# EAGLE design Proiect_TSC (EAGLE 9.7.0)
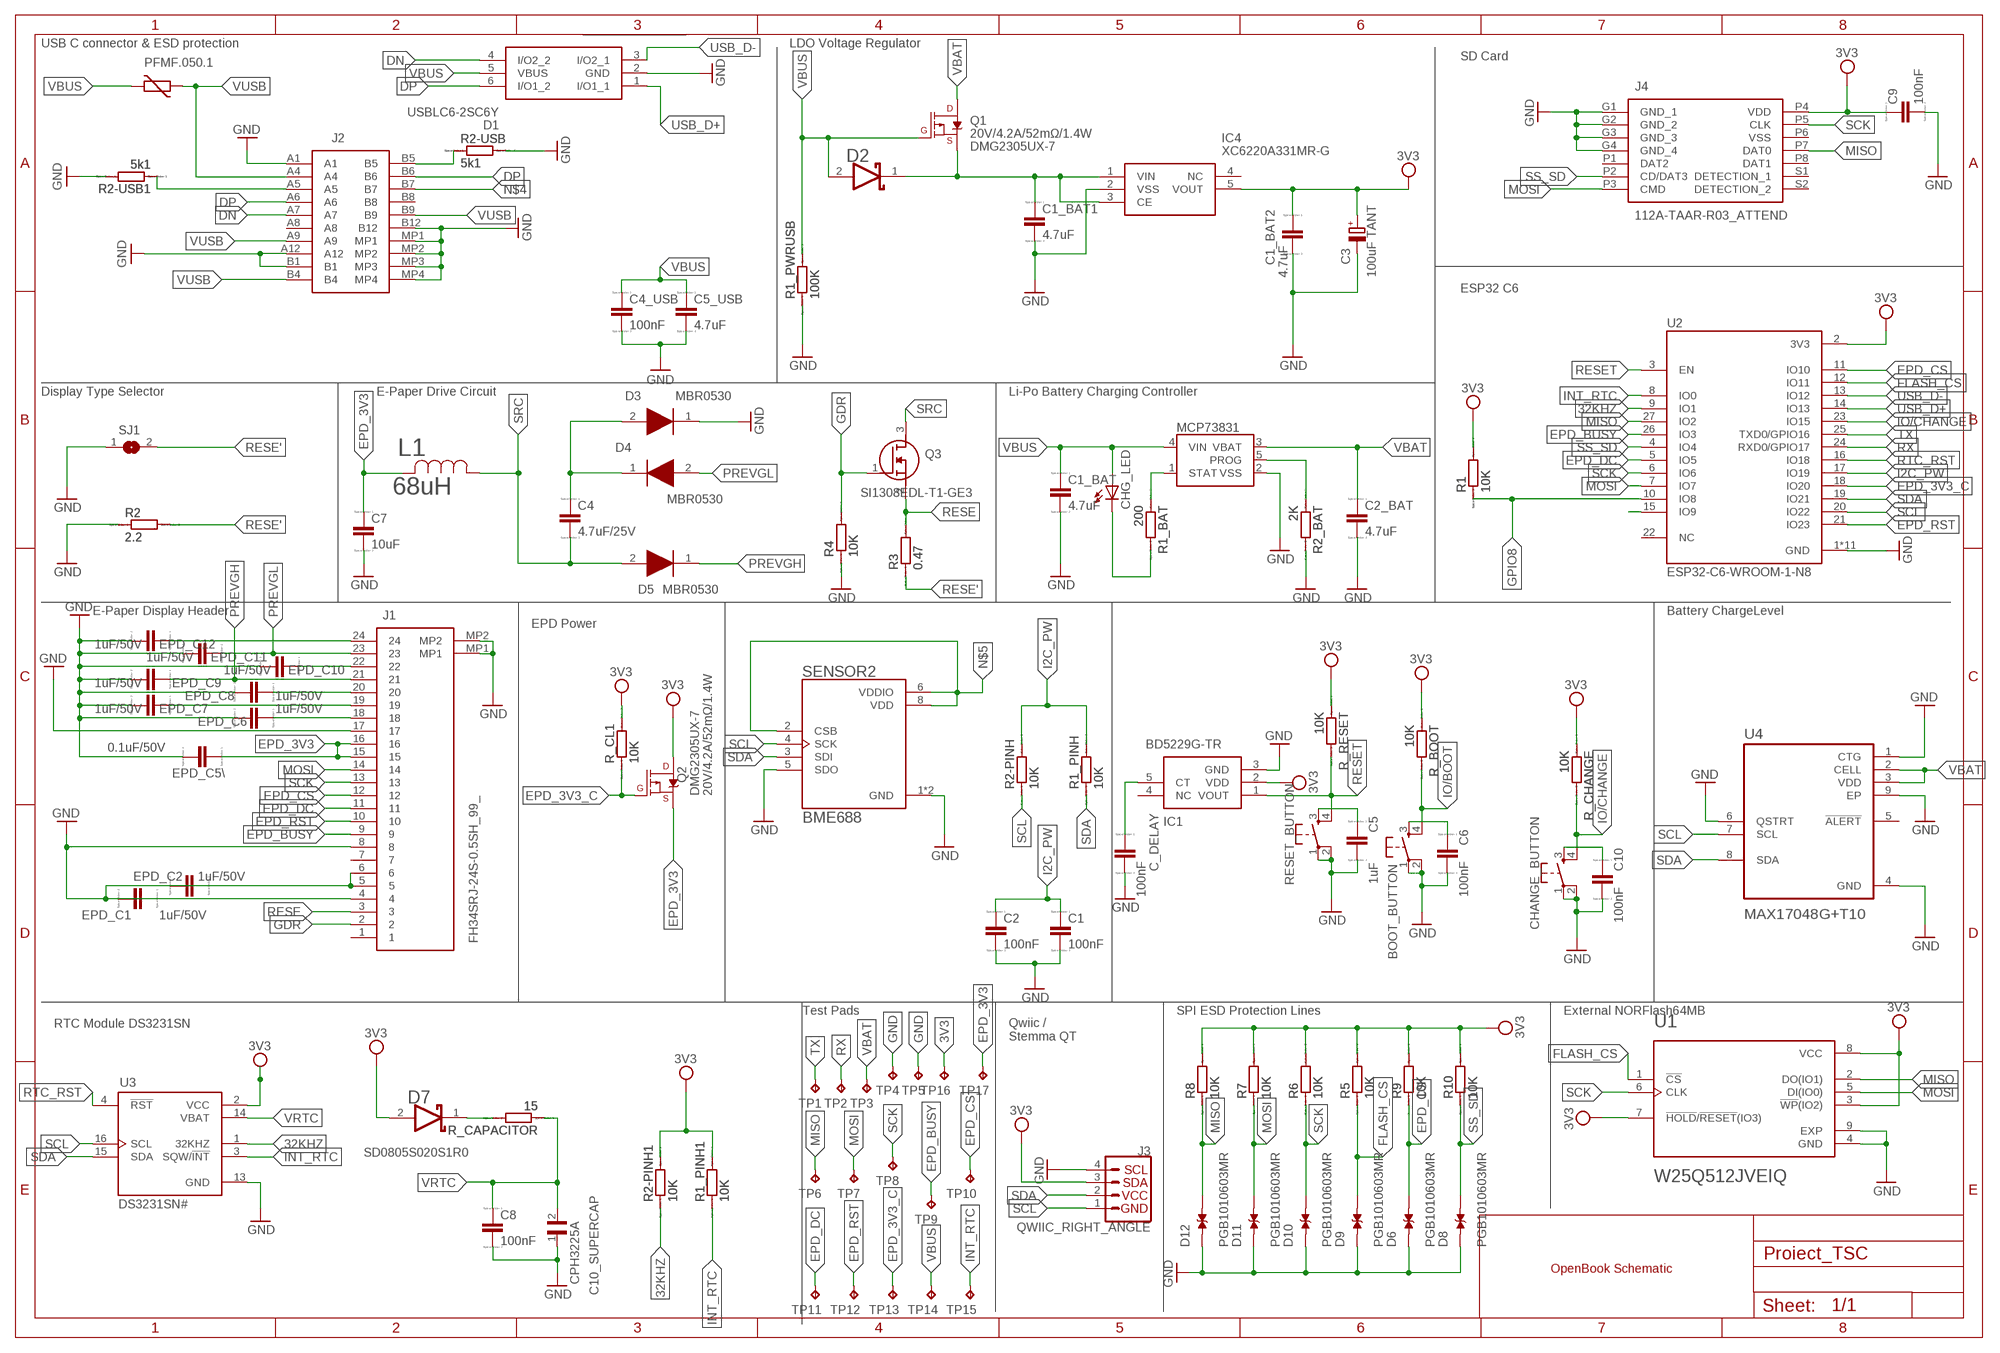
[diagram p0: schematic, sheet 1]

## Parts
BOOT_BUTTON  BUTTON_CUSYOMV1  [MYBUTTON]
C1  100nF  ESP32_WROVER_EAGLE-LTSPICE_CC0402  [ESP32_WROVER_EAGLE-LTSPICE_C0402]
C1_BAT  4.7uF  ESP32_WROVER_EAGLE-LTSPICE_CC0402  [ESP32_WROVER_EAGLE-LTSPICE_C0402]
C1_BAT1  4.7uF  ESP32_WROVER_EAGLE-LTSPICE_CC0402  [ESP32_WROVER_EAGLE-LTSPICE_C0402]
C1_BAT2  4.7uF  ESP32_WROVER_EAGLE-LTSPICE_CC0402  [ESP32_WROVER_EAGLE-LTSPICE_C0402]
C2  100nF  ESP32_WROVER_EAGLE-LTSPICE_CC0402  [ESP32_WROVER_EAGLE-LTSPICE_C0402]
C2_BAT  4.7uF  ESP32_WROVER_EAGLE-LTSPICE_CC0402  [ESP32_WROVER_EAGLE-LTSPICE_C0402]
C3  100uF TANT  RCL_CPOL-EUCT3528  [RCL_CT3528]
C4  4.7uF/25V  ESP32_WROVER_EAGLE-LTSPICE_CC0402  [ESP32_WROVER_EAGLE-LTSPICE_C0402]
C4_USB  100nF  ESP32_WROVER_EAGLE-LTSPICE_CC0402  [ESP32_WROVER_EAGLE-LTSPICE_C0402]
C5  1uF  ESP32_WROVER_EAGLE-LTSPICE_CC0402  [ESP32_WROVER_EAGLE-LTSPICE_C0402]
C5_USB  4.7uF  ESP32_WROVER_EAGLE-LTSPICE_CC0402  [ESP32_WROVER_EAGLE-LTSPICE_C0402]
C6  100nF  ESP32_WROVER_EAGLE-LTSPICE_CC0402  [ESP32_WROVER_EAGLE-LTSPICE_C0402]
C7  10uF  ESP32_WROVER_EAGLE-LTSPICE_CC0402  [ESP32_WROVER_EAGLE-LTSPICE_C0402]
C8  100nF  ESP32_WROVER_EAGLE-LTSPICE_CC0402  [ESP32_WROVER_EAGLE-LTSPICE_C0402]
C9  100nF  ESP32_WROVER_EAGLE-LTSPICE_CC0402  [ESP32_WROVER_EAGLE-LTSPICE_C0402]
C10  100nF  ESP32_WROVER_EAGLE-LTSPICE_CC0402  [ESP32_WROVER_EAGLE-LTSPICE_C0402]
C10_SUPERCAP  CPH3225A  [CAPCP3225X100N]
C_DELAY  100nF  ESP32_WROVER_EAGLE-LTSPICE_CC0402  [ESP32_WROVER_EAGLE-LTSPICE_C0402]
CHANGE_BUTTON  BUTTON_CUSYOMV1  [MYBUTTON]
CHG_LED  ADAFRUIT_LEDCHIP-LED0603  [ADAFRUIT_CHIP-LED0603]
D1  USBLC6-2SC6Y  [SOT95P280X145-6N]
D2  ESP32_WROVER_AVX---SD0805S020S1R0_AVX_SD0805S020S1R0_0_0AVX_SD0805S020S1R0_0_0  [ESP32_WROVER_AVX---SD0805S020S1R0_AVX_SD0805S020S1R0_0]
D3  MBR0530  [SOD3716X135N]
D4  MBR0530  [SOD3716X135N]
D5  MBR0530  [SOD3716X135N]
D6  PGB1010603MR  [DIOC1608X36N]
D7  ESP32_WROVER_AVX---SD0805S020S1R0_AVX_SD0805S020S1R0_0_0AVX_SD0805S020S1R0_0_0  [ESP32_WROVER_AVX---SD0805S020S1R0_AVX_SD0805S020S1R0_0]
D8  PGB1010603MR  [DIOC1608X36N]
D9  PGB1010603MR  [DIOC1608X36N]
D10  PGB1010603MR  [DIOC1608X36N]
D11  PGB1010603MR  [DIOC1608X36N]
D12  PGB1010603MR  [DIOC1608X36N]
EPD_C1  1uF/50V  ESP32_WROVER_EAGLE-LTSPICE_CC0402  [ESP32_WROVER_EAGLE-LTSPICE_C0402]
EPD_C2  1uF/50V  ESP32_WROVER_EAGLE-LTSPICE_CC0402  [ESP32_WROVER_EAGLE-LTSPICE_C0402]
EPD_C5\  0.1uF/50V  EAGLE-LTSPICE_CC0402  [EAGLE-LTSPICE_C0402]
EPD_C6  1uF/50V  EAGLE-LTSPICE_CC0402  [EAGLE-LTSPICE_C0402]
EPD_C7  1uF/50V  EAGLE-LTSPICE_CC0402  [EAGLE-LTSPICE_C0402]
EPD_C8  1uF/50V  EAGLE-LTSPICE_CC0402  [EAGLE-LTSPICE_C0402]
EPD_C9  1uF/50V  EAGLE-LTSPICE_CC0402  [EAGLE-LTSPICE_C0402]
EPD_C10  1uF/50V  EAGLE-LTSPICE_CC0402  [EAGLE-LTSPICE_C0402]
EPD_C11  1uF/50V  EAGLE-LTSPICE_CC0402  [EAGLE-LTSPICE_C0402]
EPD_C12  1uF/50V  EAGLE-LTSPICE_CC0402  [EAGLE-LTSPICE_C0402]
IC1  BD5229G-TR  [SOT95P280X125-5N]
IC4  XC6220A331MR-G  [SOT95P280X120-5N]
J1  FH34SRJ-24S-0.5SH_99_  [FH34SRJ24S05SH99]
J2  SAMACSYS_PARTS_USB4110-GF-A  [SAMACSYS_PARTS_USB4110GFA]
J3  QWIIC_RIGHT_ANGLE  QWIIC_CONNECTORJS-1MM  [JST04_1MM_RA]
J4  112A-TAAR-R03_ATTEND  [112ATAARR03ATTEND]
L1  68uH  744043680IND_4828-WE-TPC_WRE  [IND_4828-WE-TPC_WRE]
MCP73831  ESP32_WROVER_SPARKFUN-IC-POWER_MCP73831  [ESP32_WROVER_SPARKFUN-IC-POWER_SOT23-5]
PFMF.050.1  ESP32C6_VARISTORCN1812  [ESP32C6_VARISTOR_CT/CN1812]
Q1  20V/4.2A/52mΩ/1.4W  ESP32_WROVER_SPARKFUN-DISCRETESEMI_MOSFET_PCH-DMG2305UX-7  [ESP32_WROVER_SPARKFUN-DISCRETESEMI_SOT23-3]
Q2  20V/4.2A/52mΩ/1.4W  ESP32_WROVER_SPARKFUN-DISCRETESEMI_MOSFET_PCH-DMG2305UX-7  [ESP32_WROVER_SPARKFUN-DISCRETESEMI_SOT23-3]
Q3  SI1308EDL-T1-GE3  [SOT65P210X110-3N]
R1  10K  ESP32_WROVER_EAGLE-LTSPICE_RR0402  [ESP32_WROVER_EAGLE-LTSPICE_R0402]
R1_BAT  200  ESP32_WROVER_EAGLE-LTSPICE_RR0402  [ESP32_WROVER_EAGLE-LTSPICE_R0402]
R1_PINH  10K  ESP32_WROVER_EAGLE-LTSPICE_RR0402  [ESP32_WROVER_EAGLE-LTSPICE_R0402]
R1_PINH1  10K  ESP32_WROVER_EAGLE-LTSPICE_RR0402  [ESP32_WROVER_EAGLE-LTSPICE_R0402]
R1_PWRUSB  100K  ESP32_WROVER_EAGLE-LTSPICE_RR0402  [ESP32_WROVER_EAGLE-LTSPICE_R0402]
R2  2.2  ESP32_WROVER_EAGLE-LTSPICE_RR0402  [ESP32_WROVER_EAGLE-LTSPICE_R0402]
R2-PINH  10K  ESP32_WROVER_EAGLE-LTSPICE_RR0402  [ESP32_WROVER_EAGLE-LTSPICE_R0402]
R2-PINH1  10K  ESP32_WROVER_EAGLE-LTSPICE_RR0402  [ESP32_WROVER_EAGLE-LTSPICE_R0402]
R2-USB  5k1  ESP32_WROVER_EAGLE-LTSPICE_RR0402  [ESP32_WROVER_EAGLE-LTSPICE_R0402]
R2-USB1  5k1  ESP32_WROVER_EAGLE-LTSPICE_RR0402  [ESP32_WROVER_EAGLE-LTSPICE_R0402]
R2_BAT  2K  ESP32_WROVER_EAGLE-LTSPICE_RR0402  [ESP32_WROVER_EAGLE-LTSPICE_R0402]
R3  0.47  ESP32_WROVER_EAGLE-LTSPICE_RR0402  [ESP32_WROVER_EAGLE-LTSPICE_R0402]
R4  10K  ESP32_WROVER_EAGLE-LTSPICE_RR0402  [ESP32_WROVER_EAGLE-LTSPICE_R0402]
R5  10K  ESP32_WROVER_EAGLE-LTSPICE_RR0402  [ESP32_WROVER_EAGLE-LTSPICE_R0402]
R6  10K  ESP32_WROVER_EAGLE-LTSPICE_RR0402  [ESP32_WROVER_EAGLE-LTSPICE_R0402]
R7  10K  ESP32_WROVER_EAGLE-LTSPICE_RR0402  [ESP32_WROVER_EAGLE-LTSPICE_R0402]
R8  10K  ESP32_WROVER_EAGLE-LTSPICE_RR0402  [ESP32_WROVER_EAGLE-LTSPICE_R0402]
R9  10K  ESP32_WROVER_EAGLE-LTSPICE_RR0402  [ESP32_WROVER_EAGLE-LTSPICE_R0402]
R10  10K  ESP32_WROVER_EAGLE-LTSPICE_RR0402  [ESP32_WROVER_EAGLE-LTSPICE_R0402]
R_BOOT  10K  ESP32_WROVER_EAGLE-LTSPICE_RR0402  [ESP32_WROVER_EAGLE-LTSPICE_R0402]
R_CAPACITOR  15  ESP32_WROVER_EAGLE-LTSPICE_RR0402  [ESP32_WROVER_EAGLE-LTSPICE_R0402]
R_CHANGE  10K  ESP32_WROVER_EAGLE-LTSPICE_RR0402  [ESP32_WROVER_EAGLE-LTSPICE_R0402]
R_CL1  10K  ESP32_WROVER_EAGLE-LTSPICE_RR0402  [ESP32_WROVER_EAGLE-LTSPICE_R0402]
R_RESET  10K  ESP32_WROVER_EAGLE-LTSPICE_RR0402  [ESP32_WROVER_EAGLE-LTSPICE_R0402]
RESET_BUTTON  BUTTON_CUSYOMV1  [MYBUTTON]
SENSOR2  BME688  ESP32_WROVER_BME680_BME680  [ESP32_WROVER_BME680_PSON80P300X300X100-8N]
SJ1  SJ  [SJ]
TP1  TPTP20R  [TP20R]
TP2  TPTP20R  [TP20R]
TP3  TPTP20R  [TP20R]
TP4  TPTP20R  [TP20R]
TP5  TPTP20R  [TP20R]
TP6  TPTP20R  [TP20R]
TP7  TPTP20R  [TP20R]
TP8  TPTP20R  [TP20R]
TP9  TPTP20R  [TP20R]
TP10  TPTP20R  [TP20R]
TP11  TPTP20R  [TP20R]
TP12  TPTP20R  [TP20R]
TP13  TPTP20R  [TP20R]
TP14  TPTP20R  [TP20R]
TP15  TPTP20R  [TP20R]
TP16  TPTP20R  [TP20R]
TP17  TPTP20R  [TP20R]
U1  W25Q512JVEIQ  [SON127P600X800X80-9N]
U2  ESP32-C6-WROOM-1-N8  [XCVR_ESP32-C6-WROOM-1-N8]
U3  DS3231SN#  [SOIC127P1032X265-16N]
U4  MAX17048G+T10  [SON50P200X200X80-9N]

## Nets
3V3: C1_BAT2.1 C3.+ C9.1 D7.2(ANODE) IC1.2(VDD) IC4.5(VOUT) J3.3 J4.P4(VDD) Q2.3(D) R1.2 R1_PINH1.2 R2-PINH1.2 R5.2 R6.2 R7.2 R8.2 R9.2 R10.2 R_BOOT.1 R_CHANGE.1 R_CL1.2 R_RESET.1 TP16.TP U1.3(!WP!(IO2)) U1.7(!HOLD!/!RESET!(IO3)) U1.8(VCC) U2.2(3V3) U3.2(VCC)
32KHZ: R2-PINH1.1 U2.9(IO1) U3.1(32KHZ)
DN: D1.4(I/O2_2) J2.A7
DP: D1.6(I/O1_2) J2.A6 J2.B6
EPD_3V3: C7.1 EPD_C5\.1 J1.15 J1.16 L1.2 Q2.2(S) TP17.TP
EPD_3V3_C: Q2.1(G) R_CL1.1 TP13.TP U2.18(IO20)
EPD_BUSY: J1.9 TP9.TP U2.26(IO3)
EPD_C2: EPD_C2.2 J1.5 J1.6
EPD_CS: D6.2 J1.12 R9.1 TP10.TP U2.11(IO10)
EPD_DC: J1.11 TP11.TP U2.5(IO5)
EPD_RST: J1.10 TP12.TP U2.21(IO23)
FLASH_CS: D9.2 R5.1 U1.1(!CS) U2.12(IO11)
GDR: J1.2 Q3.1(G) R4.2
GND: BOOT_BUTTON.2 C1.2 C1_BAT1.2 C1_BAT2.2 C1_BAT.2 C2.2 C2_BAT.2 C3.- C4_USB.2 C5.2 C5_USB.2 C6.2 C7.2 C8.2 C9.2 C10.2 C10_SUPERCAP.1 C_DELAY.2 CHANGE_BUTTON.2 D1.2(GND) D3.1(K) D6.1 D8.1 D9.1 D10.1 D11.1 D12.1 EPD_C1.1 EPD_C2.1 EPD_C5\.2 EPD_C6.2 EPD_C7.2 EPD_C8.2 EPD_C9.2 EPD_C10.2 EPD_C11.2 EPD_C12.2 IC1.3(GND) IC4.2(VSS) J1.8 J1.17 J1.MP1 J1.MP2 J2.A1 J2.A12 J2.B1 J2.B12 J2.MP1 J2.MP2 J2.MP3 J2.MP4 J3.4 J4.G1(GND_1) J4.G2(GND_2) J4.G3(GND_3) J4.G4(GND_4) MCP73831.2(VSS) R1_PWRUSB.1 R2-USB1.2 R2-USB.2 R2.1 R2_BAT.2 R4.1 RESET_BUTTON.1 RESET_BUTTON.2 SENSOR2.1(GND) SENSOR2.5(SDO) SENSOR2.7(GND) SJ1.1 TP4.TP TP5.TP U1.4(GND) U1.9(EXP) U2.1(GND) U2.28(GND) U2.29_1(GND) U2.29_2(GND) U2.29_3(GND) U2.29_4(GND) U2.29_5(GND) U2.29_6(GND) U2.29_7(GND) U2.29_8(GND) U2.29_9(GND) U3.13(GND) U4.1(CTG) U4.4(GND) U4.6(QSTRT) U4.9(EP)
GPIO8: R1.1 U2.10(IO8)
I2C_PW: C1.1 C2.1 R1_PINH.2 R2-PINH.2 U2.17(IO19)
INT_RTC: R1_PINH1.1 TP15.TP U2.8(IO0) U3.3(SQW/!INT)
IO/BOOT: BOOT_BUTTON.4 R_BOOT.2
IO/CHANGE: CHANGE_BUTTON.4 R_CHANGE.2 U2.23(IO15)
MISO: D12.2 J4.P7(DAT0) R8.1 TP6.TP U1.2(DO(IO1)) U2.27(IO2)
MOSI: D11.2 J1.14 J4.P3(CMD) R7.1 TP7.TP U1.5(DI(IO0)) U2.7(IO7)
N$1: J2.A5 R2-USB1.1
N$2: J2.B5 R2-USB.1
N$3: C1_BAT1.1 D2.1(CATHODE) IC4.1(VIN) IC4.3(CE) Q1.2(S)
N$4: J2.B7
N$5: SENSOR2.2(CSB) SENSOR2.6(VDDIO) SENSOR2.8(VDD)
N$6: MCP73831.5(PROG) R2_BAT.1
N$7: C4.1 D3.2(A) D4.1(K)
N$8: C_DELAY.1 IC1.5(CT)
N$9: EPD_C1.2 J1.4
N$10: MCP73831.1(STAT) R1_BAT.1
N$11: CHG_LED.C R1_BAT.2
N$12: EPD_C6.1 J1.18
N$13: EPD_C7.1 J1.19
N$14: EPD_C8.1 J1.20
N$15: D7.1(CATHODE) R_CAPACITOR.2
N$16: EPD_C10.1 J1.22
N$17: BOOT_BUTTON.3 C6.1
N$18: EPD_C12.1 J1.24
N$19: C5.1 RESET_BUTTON.3
N$20: BOOT_BUTTON.1
N$21: C10.1 CHANGE_BUTTON.3
N$22: CHANGE_BUTTON.1
N$33: U2.15(IO9)
PREVGH: D5.1(K) EPD_C9.1 J1.21
PREVGL: D4.2(A) EPD_C11.1 J1.23
RESE: J1.3 Q3.2(S) R3.2
RESE': R2.2 R3.1 SJ1.2
RESET: IC1.1(VOUT) R_RESET.2 RESET_BUTTON.4 U2.3(EN)
RTC_RST: U2.16(IO18) U3.4(!RST)
RX: TP2.TP U2.24(RXD0/GPIO17)
SCK: D10.2 J1.13 J4.P5(CLK) R6.1 TP8.TP U1.6(CLK) U2.6(IO6)
SCL: J3.1 R2-PINH.1 SENSOR2.4(SCK) U2.20(IO22) U3.16(SCL) U4.7(SCL)
SDA: J3.2 R1_PINH.1 SENSOR2.3(SDI) U2.19(IO21) U3.15(SDA) U4.8(SDA)
SRC: C4.2 D5.2(A) L1.1 Q3.3(D)
SS_SD: D8.2 J4.P2(CD/DAT3) R10.1 U2.4(IO4)
TX: TP1.TP U2.25(TXD0/GPIO16)
USB_D+: D1.1(I/O1_1) U2.14(IO13)
USB_D-: D1.3(I/O2_1) U2.13(IO12)
VBAT: C2_BAT.1 MCP73831.3(VBAT) Q1.3(D) TP3.TP U4.2(CELL) U4.3(VDD)
VBUS: C1_BAT.1 C4_USB.1 C5_USB.1 CHG_LED.A D1.5(VBUS) D2.2(ANODE) MCP73831.4(VIN) PFMF.050.1.2 Q1.1(G) R1_PWRUSB.2 TP14.TP
VRTC: C8.1 C10_SUPERCAP.2 R_CAPACITOR.1 U3.14(VBAT)
VUSB: J2.A4 J2.A9 J2.B4 J2.B9 PFMF.050.1.1
Unconnected: IC1.4(NC) IC4.4(NC) J1.1 J1.7 J2.A8 J2.B8 J4.P1(DAT2) J4.P6(VSS) J4.P8(DAT1) J4.S1(DETECTION_1) J4.S2(DETECTION_2) U2.22(NC) U4.5(!ALERT)

## Notes on the sheet
- USB C connector & ESD protection | LDO Voltage Regulator
- SD Card
- DMG2305UX-7
- ESP32 C6
- Display Type Selector | E-Paper Drive Circuit | Li-Po Battery Charging Controller
- E-Paper Display Header | Battery ChargeLevel
- EPD Power
- DMG2305UX-7
- Test Pads | SPI ESD Protection Lines | External NORFlash64MB
- RTC Module DS3231SN
- Qwiic /
  Stemma QT
- SD0805S020S1R0
- OpenBook Schematic

## Library data of the parts
BOOT_BUTTON CHANGE_BUTTON RESET_BUTTON = DeskAssistant v19 v1:BUTTON_CUSYOMV1
C1 C1_BAT C1_BAT1 C1_BAT2 C2 C2_BAT C4 C4_USB C5 C5_USB C6-C10 C_DELAY EPD_C1 EPD_C2 = DeskAssistant v19 v1:ESP32_WROVER_EAGLE-LTSPICE_C: CAPACITOR, European symbol; SPICEMODEL: NONE; SPICEPREFIX: C
C3 = DeskAssistant v19 v1:RCL_CPOL-EU: POLARIZED CAPACITOR, European symbol; SPICEPREFIX: C
C10_SUPERCAP = DeskAssistant v19 v1:CPH3225A: Cap 0.011F 3.3V 1210 Flat Check availability <https://pricing.snapeda.com/parts/CPH3225A/Seiko%20Instruments/view-part?ref=eda>; AVAILABILITY: Not in stock; CHECK_PRICES: https://www.snapeda.com/parts/CPH3225A/Seiko+Instruments/view-part/?ref=eda; DESCRIPTION: 11 mF (EDLC) Supercapacitor 3.3 V 1210 (3225 Metric) - -; MF: Seiko Instruments; MP: CPH3225A; PACKAGE: 1210 Seiko; PRICE: None; PURCHASE-URL: https://www.snapeda.com/api/url_track_click_mouser/?unipart_id=562593&manufacturer=Seiko Instruments&part_name=CPH3225A&search_term=None; SNAPEDA_LINK: https://www.snapeda.com/parts/CPH3225A/Seiko+Instruments/view-part/?ref=snap
CHG_LED = DeskAssistant v19 v1:ADAFRUIT_LED: LED OSRAM: - CHIPLED LG R971, LG N971, LY N971, LG Q971, LY Q971, LO R971, LY R971 LH N974, LH R974 LS Q976, LO Q976, LY Q976 LO Q996 - Hyper CHIPLED LW Q18S LB Q993, LB Q99A, LB R99A - SideLED LS A670, LO A670, LY A670, LG A670, LP A670 LB A673, LV A673, LT A673, LW A673 LH A674 LY A675 LS A676, LA A676, LO A676, LY A676, LW A676 LS A679, LY A679, LG A679 - Hyper Micro SIDELED® LS Y876, LA Y876, LO Y876, LY Y876 LT Y87S - SmartLED LW L88C, LW L88S LB L89C, LB L89S, LG L890 LS L89K, LO L89K, LY L89K LS L896, LA L896, LO L896, LY L896 - TOPLED LS T670, LO T670, LY T670, LG T670, LP T670 LSG T670, LSP T670, LSY T670, LOP T670, LYG T670 LG T671, LOG T671, LSG T671 LB T673, LV T673, LT T673, LW T673 LH T674 LS T676, LA T676, LO T676, LY T676, LB T676, LH T676, LSB T676, LW T676 LB T67C, LV T67C, LT T67C, LS T67K, LO T67K, LY T67K, LW E67C LS E67B, LA E67B, LO E67B, LY E67B, LB E67C, LV E67C, LT E67C LW T67C LS T679, LY T679, LG T679 LS T770, LO T770, LY T770, LG T770, LP T770 LB T773, LV T773, LT T773, LW T773 LH T774 LS E675, LA E675, LY E675, LS T675 LS T776, LA T776, LO T776, LY T776, LB T776 LHGB T686 LT T68C, LB T68C - Hyper Mini TOPLED® LB M676 - Mini TOPLED Santana® LG M470 LS M47K, LO M47K, LY M47K Source: http://www.osram.convergy.de/
D1 = DeskAssistant v19 v1:USBLC6-2SC6Y: Low Cap. ESD Protection Auto SOT-23-6 STMicroelectronics USBLC6-2SC6Y, Dual Uni-Directional TVS Diode Array, 6-Pin SOT-23 Source: Datasheet <https://componentsearchengine.com/Datasheets/1/USBLC6-2SC6Y.pdf> Check availability <https://pricing.snapeda.com/parts/USBLC6-2SC6Y/STMicroelectronics/view-part?ref=eda>; AVAILABILITY: In Stock; CHECK_PRICES: https://www.snapeda.com/parts/USBLC6-2SC6Y/STMicroelectronics/view-part/?ref=eda; DESCRIPTION: 17V Clamp 5A (8/20µs) Ipp Tvs Diode Surface Mount SOT-23-6; MF: STMicroelectronics; MP: USBLC6-2SC6Y; PACKAGE: SOT-23-6 STMicroelectronics; PRICE: None; SNAPEDA_LINK: https://www.snapeda.com/parts/USBLC6-2SC6Y/STMicroelectronics/view-part/?ref=snap
D2 D7 = DeskAssistant v19 v1:ESP32_WROVER_AVX---SD0805S020S1R0_AVX_SD0805S020S1R0_0_0: Schottky Barrier Rectifier Diode; CENTROID_NOT_SPECIFIED: No; DATASHEET: http://datasheets.avx.com/schottky.pdf; DIGIKEY_DESCRIPTION: DIODE SCHOTTKY 20V 1A 0805; DIGIKEY_PART_NUMBER: 478-7800-1-ND; LEAD_FREE: yes; MF: AVX; MOUSER_PART_NUMBER: 581-SD0805S020S1R0; PACKAGE: 0805 (2012 metric); PREFIX: D; ROHS: yes; TEMPERATURE_RANGE_HIGH: +125°C; TEMPERATURE_RANGE_LOW: -55°C
D3-D5 = DeskAssistant v19 v1:MBR0530: ON SEMICONDUCTOR - MBR0530 - DIODE, SCHOTTKY, 0.5A, 30V, SOD-123 Source: Datasheet <http://www.onsemi.com/pub/Collateral/MBR0530T1-D.PDF> Check availability <https://pricing.snapeda.com/parts/MBR0530/ON%20Semiconductor/view-part?ref=eda>; AVAILABILITY: In Stock; CHECK_PRICES: https://www.snapeda.com/parts/MBR0530/Onsemi/view-part/?ref=eda; DESCRIPTION: Diode Schottky 30 V 500mA Surface Mount SOD-123; MF: ON Semiconductor; MP: MBR0530; PACKAGE: SOD-123-2 ON Semiconductor; PRICE: None; PURCHASE-URL: https://www.snapeda.com/api/url_track_click_mouser/?unipart_id=179458&manufacturer=ON Semiconductor&part_name=MBR0530&search_term=None; SNAPEDA_LINK: https://www.snapeda.com/parts/MBR0530/Onsemi/view-part/?ref=snap
D6 D8-D12 = DeskAssistant v19 v1:PGB1010603MR: Check availability <https://pricing.snapeda.com/parts/PGB1010603MR/Littelfuse%20Inc./view-part?ref=eda>; AVAILABILITY: In Stock; CHECK_PRICES: https://www.snapeda.com/parts/PGB1010603MR/Littelfuse/view-part/?ref=eda; DESCRIPTION: 150V (Typ) Clamp - Ipp Tvs Diode Surface Mount 0603 (1608 Metric); MF: Littelfuse Inc.; MP: PGB1010603MR; PACKAGE: 0603 Littelfuse Inc.; PRICE: None; PURCHASE-URL: https://www.snapeda.com/api/url_track_click_mouser/?unipart_id=5659453&manufacturer=Littelfuse Inc.&part_name=PGB1010603MR&search_term=None; SNAPEDA_LINK: https://www.snapeda.com/parts/PGB1010603MR/Littelfuse/view-part/?ref=snap
EPD_C5\ EPD_C6-EPD_C12 = DeskAssistant v19 v1:EAGLE-LTSPICE_C: CAPACITOR, European symbol; SPICEMODEL: NONE; SPICEPREFIX: C
IC1 = DeskAssistant v19 v1:BD5229G-TR: Voltage Detector with Adjustable Delay Time: CMOS processes are utilized to develop high precision, low current consumption CMOS reset ICs that allow arbitrary setting of the delay time. The extensive lineup includes both Nch Open Drain and CMOS output types in a wide range of detection voltages (from 2.3V to 6.0V, in 0.1V steps), enabling selection of the ideal solution based on customer requirements. In addition, the entire series is of course both lead-free and RoHS-compliant. Source: Datasheet <https://datasheet.datasheetarchive.com/originals/distributors/Datasheets_SAMA/f2b9741ef86007909f138d561a359946.pdf>; DESCRIPTION: Voltage Detector with Adjustable Delay Time: CMOS processes are utilized to develop high precision, low current consumption CMOS reset ICs that allow arbitrary setting of the delay time. The extensive lineup includes both Nch Open Drain and CMOS output types in a wide range of detection voltages (from 2.3V to 6.0V, in 0.1V steps), enabling selection of the ideal solution based on customer requirements. In addition, the entire series is of course both lead-free and RoHS-compliant.; HEIGHT: 1.25mm; MANUFACTURER_NAME: ROHM Semiconductor; MANUFACTURER_PART_NUMBER: BD5229G-TR; MOUSER_PART_NUMBER: 755-BD5229G-TR; MOUSER_PRICE-STOCK: https://www.mouser.co.uk/ProductDetail/ROHM-Semiconductor/BD5229G-TR?qs=4kLU8WoGk0vvnhrrYwdszw%3D%3D
IC4 = DeskAssistant v19 v1:XC6220A331MR-G: LDO Voltage Regulators Source: Datasheet <https://www.torexsemi.com/file/xc6220/XC6220.pdf>; DESCRIPTION: LDO Voltage Regulators; HEIGHT: 1.2mm; MANUFACTURER_NAME: Torex; MANUFACTURER_PART_NUMBER: XC6220A331MR-G; MOUSER_PART_NUMBER: 865-XC6220A331MR-G; MOUSER_PRICE-STOCK: https://www.mouser.co.uk/ProductDetail/Torex-Semiconductor/XC6220A331MR-G?qs=AsjdqWjXhJ8ZSWznL1J0gg%3D%3D
J1 = DeskAssistant v19 v1:FH34SRJ-24S-0.5SH_99_: 24 Position FFC, FPC Connector Contacts, Top and Bottom 0.020" (0.50mm) Surface Mount, Right Angle Source: Datasheet <https://www.hirose.com/en/product/document?clcode=CL0580-1255-6-99&productname=FH34SRJ-24S-0.5SH(99)&series=FH34SRJ&documenttype=2DDrawing&lang=en&documentid=0000990903>; DESCRIPTION: 24 Position FFC, FPC Connector Contacts, Top and Bottom 0.020" (0.50mm) Surface Mount, Right Angle; HEIGHT: 1.1mm; MANUFACTURER_NAME: Hirose; MANUFACTURER_PART_NUMBER: FH34SRJ-24S-0.5SH(99); MOUSER_PART_NUMBER: 798-FH34SRJ24S05SH99; MOUSER_PRICE-STOCK: https://www.mouser.co.uk/ProductDetail/Hirose-Connector/FH34SRJ-24S-0.5SH99?qs=vcbW%252B4%252BSTIpKBl5ap9J8Fw%3D%3D
J2 = DeskAssistant v19 v1:SAMACSYS_PARTS_USB4110-GF-A: CONN USB 2.0 TYPE-C R/A SMT Source: Datasheet <https://gct.co/files/drawings/usb4110.pdf>; DESCRIPTION: CONN USB 2.0 TYPE-C R/A SMT; HEIGHT: 3.26mm; MANUFACTURER_NAME: GCT (GLOBAL CONNECTOR TECHNOLOGY); MANUFACTURER_PART_NUMBER: USB4110-GF-A; MOUSER_PART_NUMBER: 640-USB4110-GF-A; MOUSER_PRICE-STOCK: https://www.mouser.co.uk/ProductDetail/GCT/USB4110-GF-A?qs=KUoIvG%2F9IlYiZvIXQjyJeA%3D%3D
J3 = DeskAssistant v19 v1:QWIIC_CONNECTOR: SparkFun I2C Standard Qwiic Connector An SMD 1mm pitch JST connector makes it easy and quick (get it? Qwiic?) to connect I2C devices to each other. The Qwiic system <http://www.sparkfun.com/qwiic> enables fast and solderless connection between popular platforms and various sensors and actuators. We carry 200mm <https://www.sparkfun.com/products/14204>, 100mm <https://www.sparkfun.com/products/14205>, 50mm <https://www.sparkfun.com/products/14206>, and breadboard friendly <https://www.sparkfun.com/products/14207> Qwiic cables. We also offer 10 pcs strips <https://www.sparkfun.com/products/14323> the SMD connectors.; PROD_ID: CONN-13694
J4 = DeskAssistant v19 v1:112A-TAAR-R03_ATTEND: Micro SD Card Socket, Push-Push Type, Top Mount, SMT, H=1.83mm, 10u Source: Datasheet <https://www.attend.com.tw/data/download/file/112A-TAAR-R03.pdf>; DESCRIPTION: Micro SD Card Socket, Push-Push Type, Top Mount, SMT, H=1.83mm, 10u; HEIGHT: 1.9mm; MANUFACTURER_NAME: ATTEND; MANUFACTURER_PART_NUMBER: 112A-TAAR-R03 ATTEND
L1 = DeskAssistant v19 v1:744043680; COPYRIGHT: Copyright (C) 2024 Ultra Librarian. All rights reserved.; MANUFACTURER_PART_NUMBER: 744043680; MFR_NAME: Wurth Electronics
MCP73831 = DeskAssistant v19 v1:ESP32_WROVER_SPARKFUN-IC-POWER_MCP73831: MCP73831T Li-Ion, Li-Pol Controller Miniature single cell, fully integrated Li-Ion, Li-polymer charge management controller Datasheet <http://ww1.microchip.com/downloads/en/DeviceDoc/20001984g.pdf> SparkFun Products: SparkFun ESP32 Thing <https://www.sparkfun.com/products/13907> SparkFun 9DoF Razor IMU M0 <https://www.sparkfun.com/products/14001>; PROD_ID: IC-09995
PFMF.050.1 = DeskAssistant v19 v1:ESP32C6_VARISTOR: VARISTOR
Q1 Q2 = DeskAssistant v19 v1:ESP32_WROVER_SPARKFUN-DISCRETESEMI_MOSFET_PCH: P-channel MOSFETs Voltage controlled devices that allow control of high current outputs. SparkFun Products: SparkFun ESP32 Thing <https://www.sparkfun.com/products/13907> SparkFun ESP8266 Thing <https://www.sparkfun.com/products/13231> SparkFun Pi Servo HAT V2 <https://www.sparkfun.com/products/15316> DMG2305UX-7 (20V/4.2A/SOT23-3); PROD_ID: TRAN-14388
Q3 = DeskAssistant v19 v1:SI1308EDL-T1-GE3: MOSFET N-Ch 30V 1.5A TrenchFET SC70 Vishay Si1308EDL-T1-GE3 N-channel MOSFET Transistor, 1.5 A, 30 V, 3-Pin SC-70 Source: Datasheet <https://componentsearchengine.com/Datasheets/1/SI1308EDL-T1-GE3.pdf> Check availability <https://pricing.snapeda.com/parts/SI1308EDL-T1-GE3/Vishay%20Siliconix/view-part?ref=eda>; AVAILABILITY: In Stock; CHECK_PRICES: https://www.snapeda.com/parts/SI1308EDL-T1-GE3/Vishay+Siliconix/view-part/?ref=eda; DESCRIPTION: Si1308EDL-T1-GE3 N-channel MOSFET Transistor, 1.5 A, 30 V, 3-Pin SC-70 | Siliconix / Vishay SI1308EDL-T1-GE3; MF: Vishay Siliconix; MP: SI1308EDL-T1-GE3; PACKAGE: SOT-323 Vishay Semiconductor; PRICE: None; PURCHASE-URL: https://www.snapeda.com/api/url_track_click_mouser/?unipart_id=274603&manufacturer=Vishay Siliconix&part_name=SI1308EDL-T1-GE3&search_term=None; SNAPEDA_LINK: https://www.snapeda.com/parts/SI1308EDL-T1-GE3/Vishay+Siliconix/view-part/?ref=snap
R1 R1_BAT R1_PINH R1_PINH1 R1_PWRUSB R2 R2-PINH R2-PINH1 R2-USB R2-USB1 R2_BAT R3-R10 R_BOOT R_CAPACITOR R_CHANGE R_CL1 R_RESET = DeskAssistant v19 v1:ESP32_WROVER_EAGLE-LTSPICE_R: RESISTOR, European symbol; SPICEMODEL: NONE; SPICEPREFIX: R
SENSOR2 = DeskAssistant v19 v1:ESP32_WROVER_BME680_BME680: Integrated Environmental Unit; AVAILABILITY: Unavailable; DESCRIPTION: Integrated Environmental Unit; MF: Bosch Sensortec; MP: BME680; PACKAGE: LGA-8 Bosch Tools; PRICE: None
SJ1 = DeskAssistant v19 v1:SJ: SMD solder JUMPER
TP1-TP17 = DeskAssistant v19 v1:TP: Test pad
U1 = DeskAssistant v19 v1:W25Q512JVEIQ: Check availability <https://pricing.snapeda.com/parts/W25Q512JVEIQ/Winbond%20Electronics/view-part?ref=eda>; AVAILABILITY: In Stock; CHECK_PRICES: https://www.snapeda.com/parts/W25Q512JVEIQ/Winbond+Electronics/view-part/?ref=eda; DESCRIPTION: FLASH - NOR Memory IC 512Mb (64M x 8) SPI - Quad I/O 133 MHz 8-WSON (8x6); MF: Winbond Electronics; MP: W25Q512JVEIQ; PACKAGE: Package; PRICE: None; SNAPEDA_LINK: https://www.snapeda.com/parts/W25Q512JVEIQ/Winbond+Electronics/view-part/?ref=snap
U2 = DeskAssistant v19 v1:ESP32-C6-WROOM-1-N8: Check availability <https://pricing.snapeda.com/parts/ESP32-C6-WROOM-1-N8/Espressif%20Systems/view-part?ref=eda>; AVAILABILITY: In Stock; CHECK_PRICES: https://www.snapeda.com/parts/ESP32-C6-WROOM-1-N8/Espressif+Systems/view-part/?ref=eda; DESCRIPTION: Multiprotocol Modules ESP32-C6 module, Wi-Fi 6 in 2.4 GHz band, Bluetooth 5, Zigbee 3.0 and Thread. ESP34-WROOM Compatible - ENGINEERING SAMPLE; MF: Espressif Systems; MP: ESP32-C6-WROOM-1-N8; PACKAGE: None; PRICE: None; SNAPEDA_LINK: https://www.snapeda.com/parts/ESP32-C6-WROOM-1-N8/Espressif+Systems/view-part/?ref=snap
U3 = DeskAssistant v19 v1:DS3231SN#: Real Time Clock Serial 16-Pin SOIC W T/R Check availability <https://pricing.snapeda.com/parts/DS3231SN%23/Analog%20Devices/view-part?ref=eda>; AVAILABILITY: In Stock; CHECK_PRICES: https://www.snapeda.com/parts/DS3231SN%23/Analog+Devices/view-part/?ref=eda; DESCRIPTION: Extremely Accurate I²C-Integrated RTC/TCXO/Crystal; MF: Analog Devices; MP: DS3231SN#; PACKAGE: SOIC-16 Maxim; PRICE: None; PURCHASE-URL: https://www.snapeda.com/api/url_track_click_mouser/?unipart_id=99048&manufacturer=Analog Devices&part_name=DS3231SN#&search_term=None; SNAPEDA_LINK: https://www.snapeda.com/parts/DS3231SN%23/Analog+Devices/view-part/?ref=snap
U4 = DeskAssistant v19 v1:MAX17048G+T10: Check availability <https://pricing.snapeda.com/parts/MAX17048G%2BT10/Analog%20Devices/view-part?ref=eda>; AVAILABILITY: In Stock; CHECK_PRICES: https://www.snapeda.com/parts/MAX17048G+T10/Analog+Devices/view-part/?ref=eda; DESCRIPTION: 3µA 1-Cell/2-Cell Fuel Gauge with ModelGauge; MF: Analog Devices; MP: MAX17048G+T10; PACKAGE: TDFN-8 Maxim; PRICE: None; PURCHASE-URL: https://www.snapeda.com/api/url_track_click_mouser/?unipart_id=329239&manufacturer=Analog Devices&part_name=MAX17048G+T10&search_term=None; SNAPEDA_LINK: https://www.snapeda.com/parts/MAX17048G+T10/Analog+Devices/view-part/?ref=snap

## Board
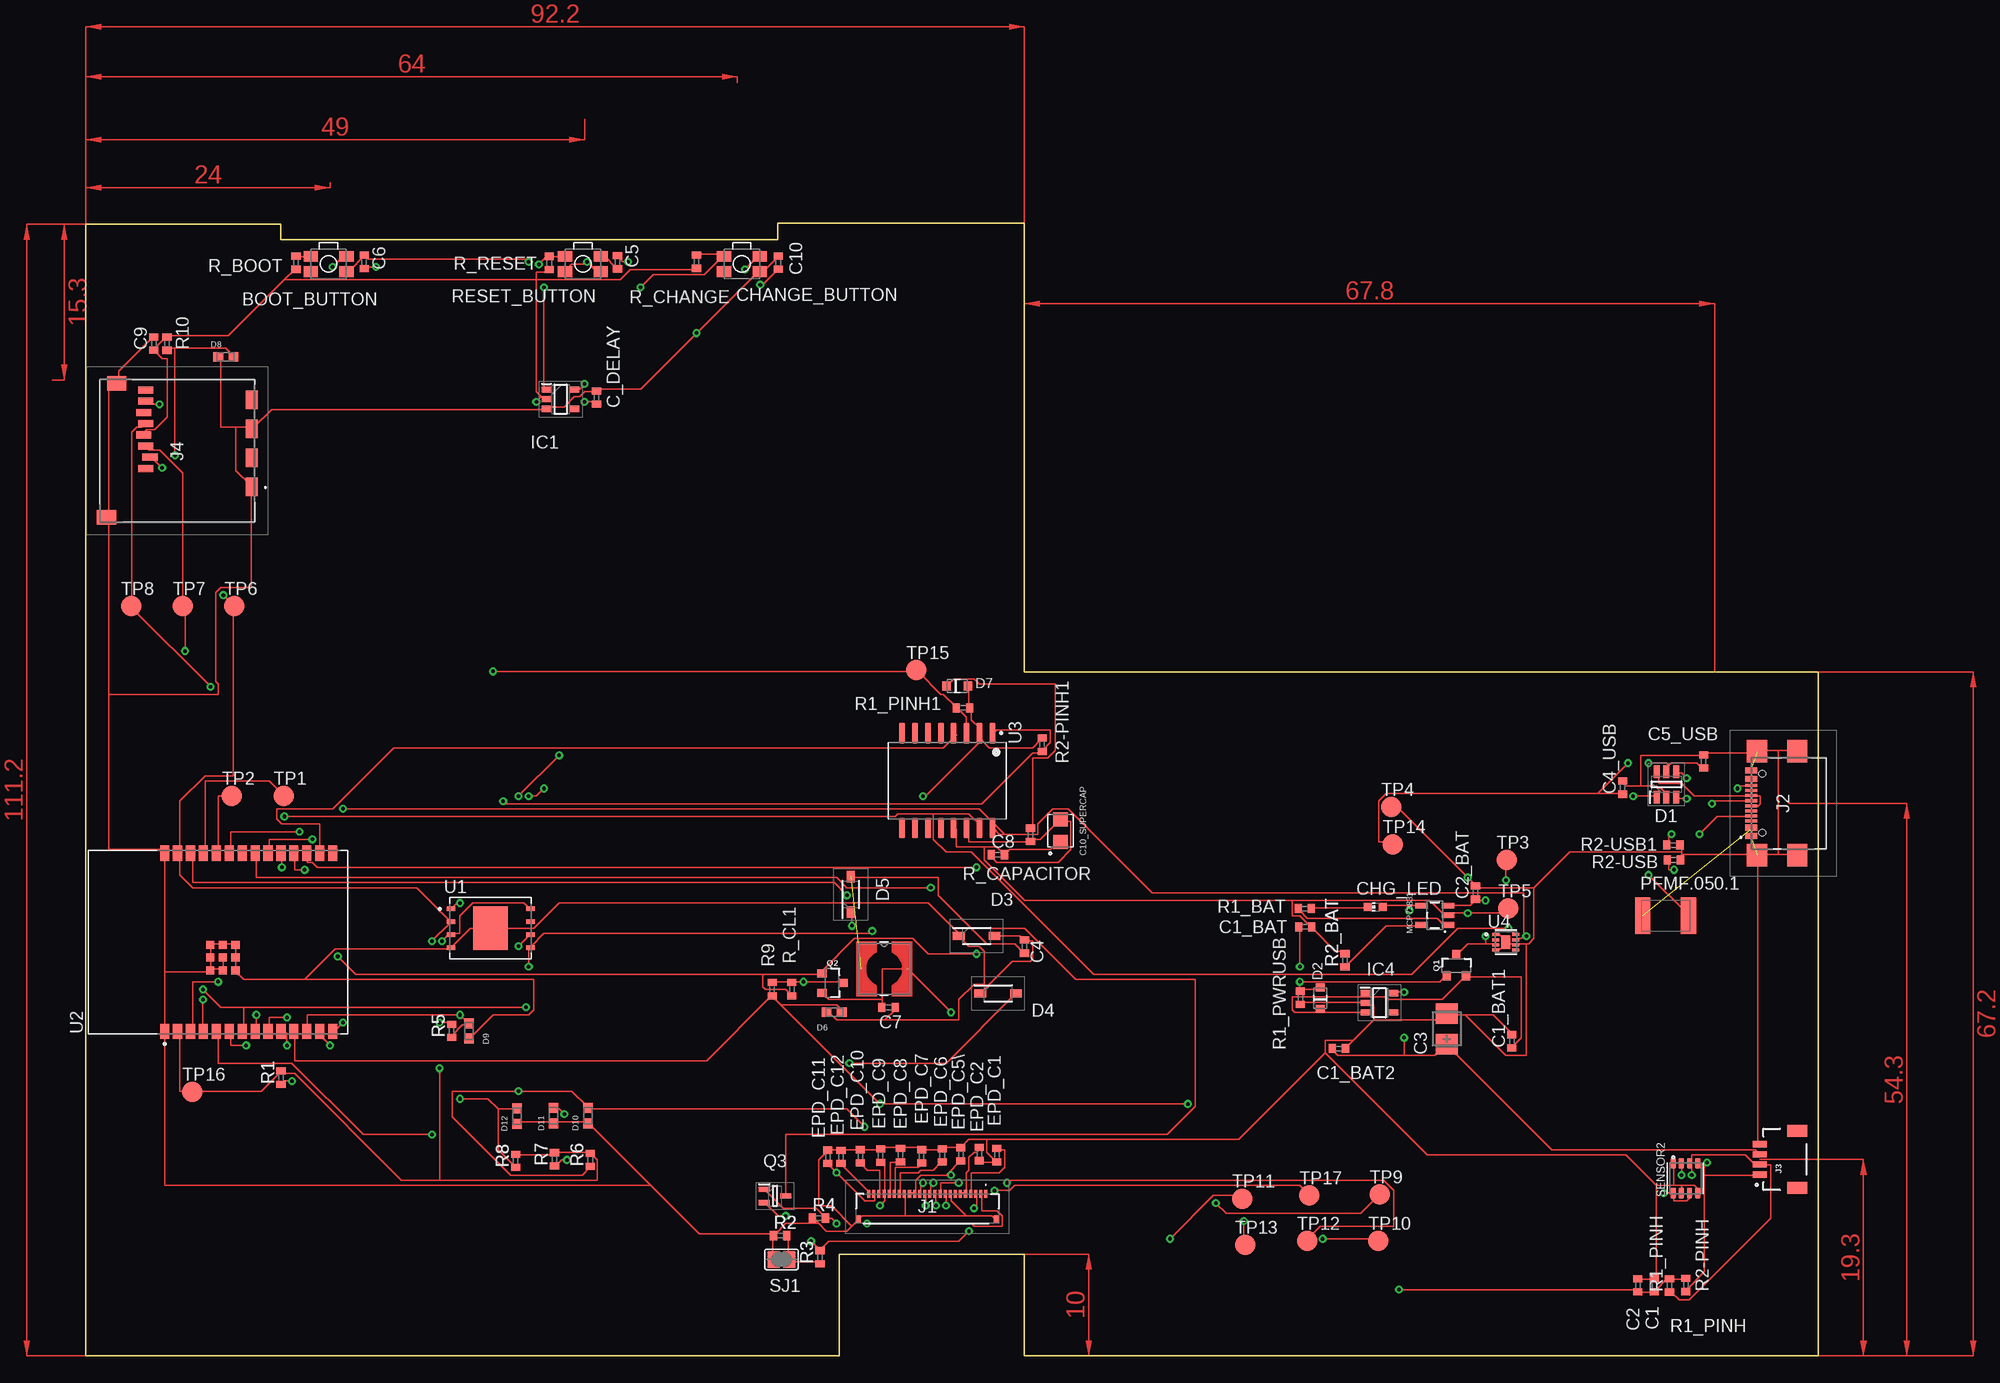
[diagram p1: board, top side]
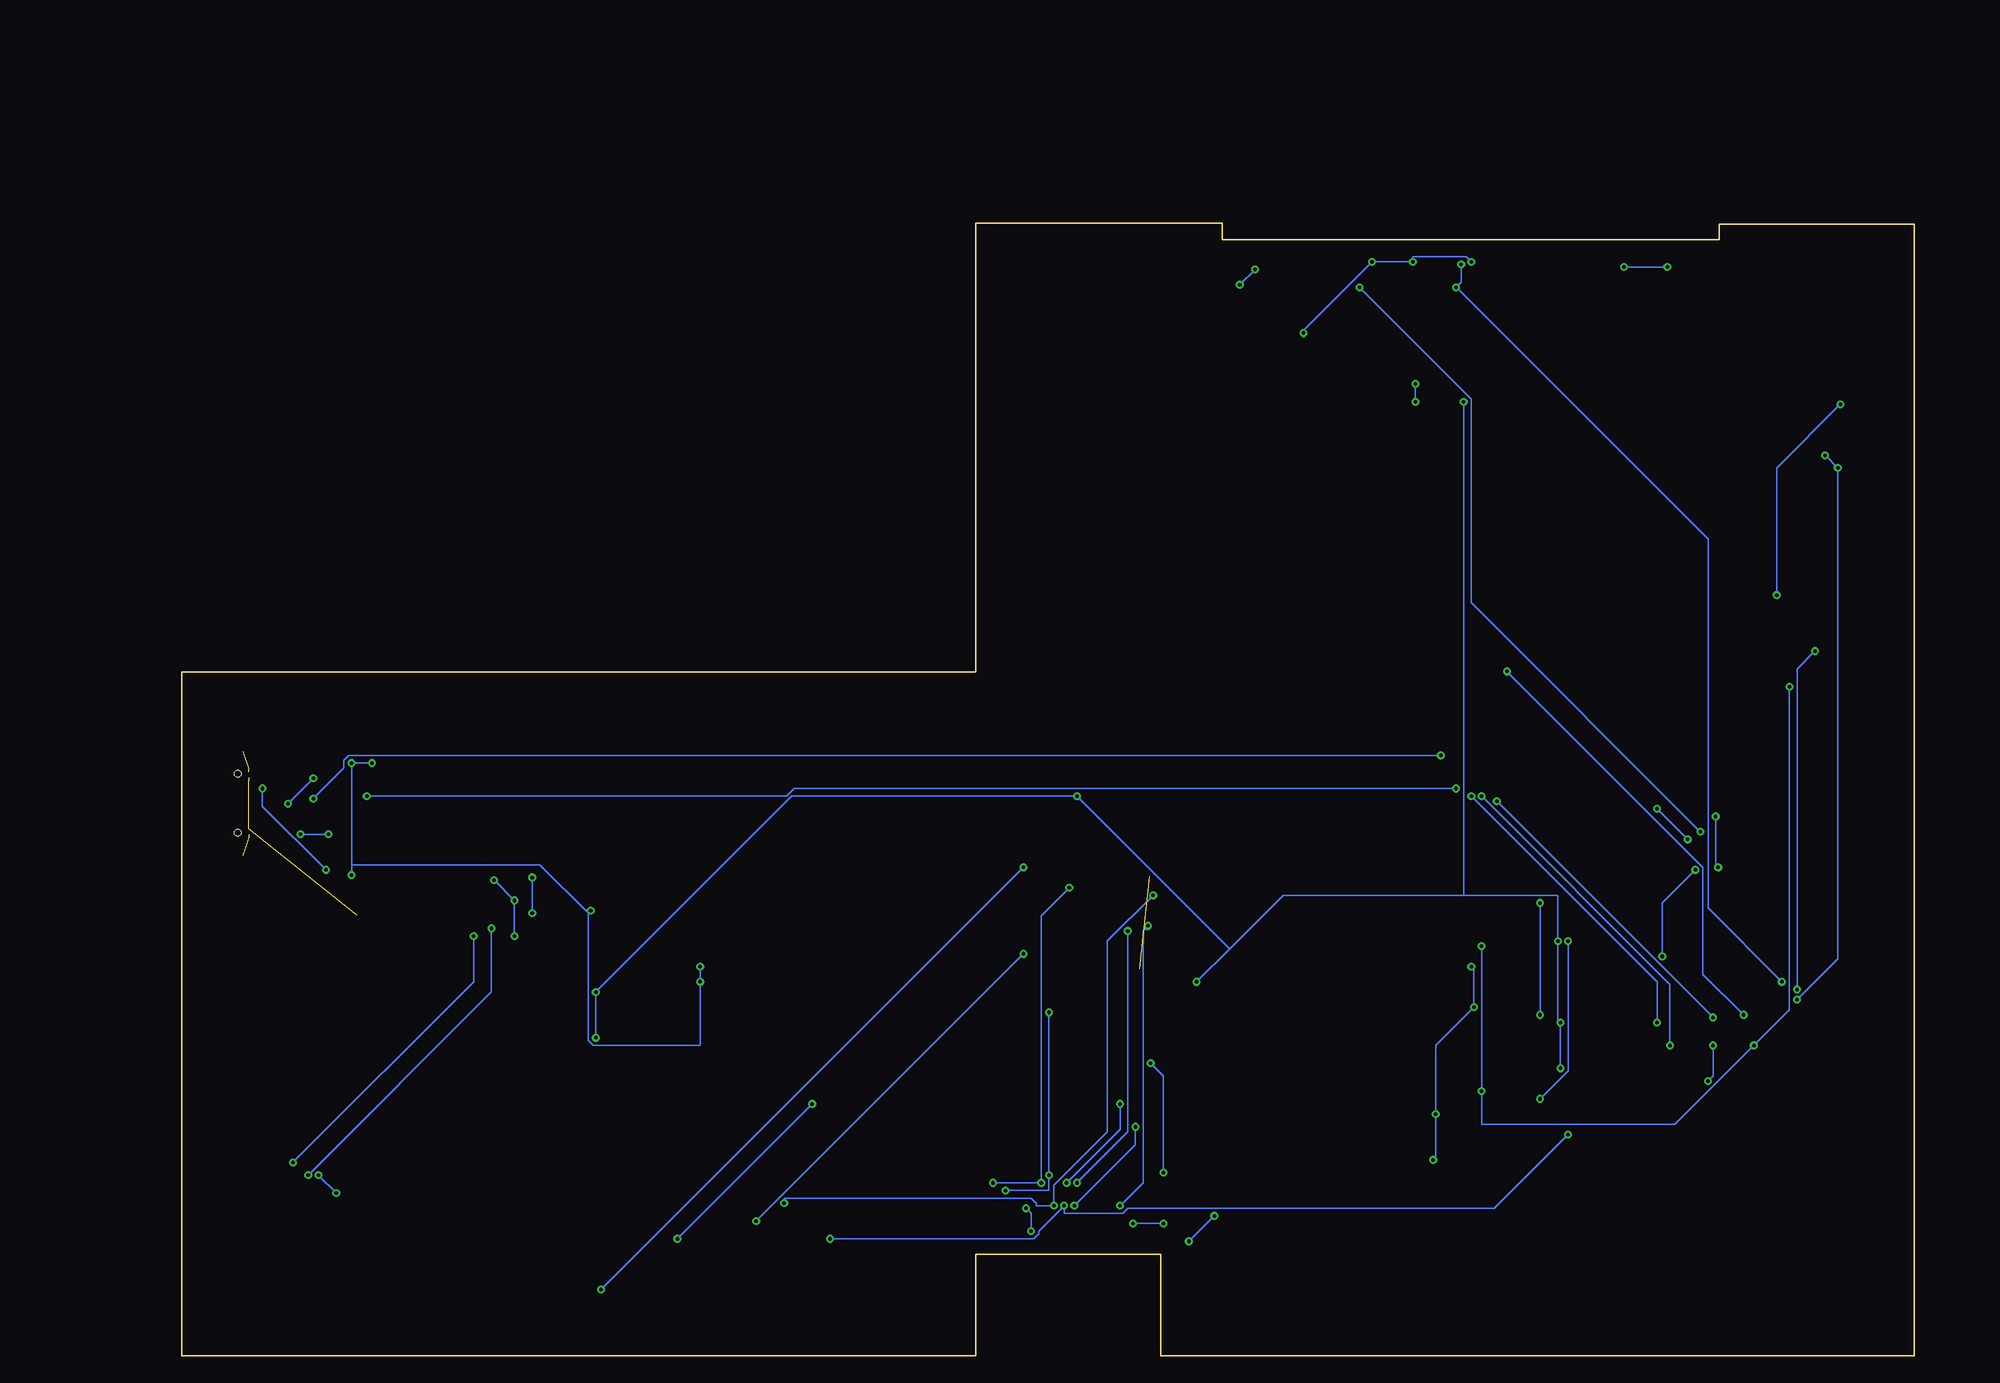
[diagram p2: board, bottom side, seen from below]

Size 170.2 x 111.3 mm. Coordinates in mm from the lower left corner, seen from the top.
Outline: 0,111.2 19.15,111.22 19.15,109.66 67.95,109.66 67.95,111.3 92.2,111.3 92.2,67.2 170.2,67.2 170.2,0 92.2,0 92.2,10 74,10 74,0 0,0 0,111.2
Copper layers (1*16): Top 0.035mm / dielectric 1.5mm / Bottom 0.035mm
Design rules "Fusion Electronics Design Rules": minimum track width 6mil, minimum drill 0.35mm, track to track 6mil, track to pad 6mil, pad to pad 6mil, via to via 6mil, smd to smd 6mil, copper to edge 40mil, drill to drill 6mil, minimum pad ring 10mil, minimum via ring 8mil, stop-mask expansion 4mil, vias tented up to drill 0mil, thermal gap 10mil

### Footprints (pad centres in the part's own frame; a part is rotated, then mirrored left to right if it is on the bottom)
MYBUTTON = smd 1.4 x 1.05: 1 1.75,0.75; 2 -1.75,0.75; 3 -1.75,-0.75; 4 1.75,-0.75
ESP32_WROVER_EAGLE-LTSPICE_C0402 = smd 0.7 x 0.9: 1 -0.65,0; 2 0.65,0
RCL_CT3528 = smd 2 x 2.2: + -1.5,0; - 1.5,0
CAPCP3225X100N = smd 1.4 x 1.4: 1 -1.1,0; 2 1.1,0
ADAFRUIT_CHIP-LED0603 = smd 0.8 x 0.8: A 0,-0.75; C 0,0.75
SOT95P280X145-6N = smd 1.2 x 0.6: 1 -1.25,0.95; 2 -1.25,0; 3 -1.25,-0.95; 4 1.25,-0.95; 5 1.25,0; 6 1.25,0.95
ESP32_WROVER_AVX---SD0805S020S1R0_AVX_SD0805S020S1R0_0 = smd 0.8 x 0.9: 1 -1.05,0; 2 1.05,0
SOD3716X135N = smd 1.15 x 0.8: 1 -1.75,0; 2 1.75,0
DIOC1608X36N = smd 0.97 x 0.94: 1 -0.75,0; 2 0.75,0
EAGLE-LTSPICE_C0402 = smd 0.7 x 0.9: 1 -0.65,0; 2 0.65,0
SOT95P280X125-5N = smd 0.9 x 0.6: 1 -1.4,0.95; 2 -1.4,0; 3 -1.4,-0.95; 4 1.4,-0.95; 5 1.4,0.95
SOT95P280X120-5N = smd 0.9 x 0.6: 1 -1.4,0.95; 2 -1.4,0; 3 -1.4,-0.95; 4 1.4,-0.95; 5 1.4,0.95
FH34SRJ24S05SH99 = smd 0.3 x 0.8: 1 5.75,1.45; 2 5.25,1.45; 3 4.75,1.45; 4 4.25,1.45; 5 3.75,1.45; 6 3.25,1.45; 7 2.75,1.45; 8 2.25,1.45; 9 1.75,1.45; 10 1.25,1.45; 11 0.75,1.45; 12 0.25,1.45; 13 -0.25,1.45; 14 -0.75,1.45; 15 -1.25,1.45; 16 -1.75,1.45; 17 -2.25,1.45; 18 -2.75,1.45; 19 -3.25,1.45; 20 -3.75,1.45; 21 -4.25,1.45; 22 -4.75,1.45; 23 -5.25,1.45; 24 -5.75,1.45 | smd 0.4 x 0.8: MP1 6.75,-1.05; MP2 -6.75,-1.05
SAMACSYS_PARTS_USB4110GFA = smd 0.3 x 1.15: A1 -3.35,3.678; A4 -2.55,3.678; A5 -1.25,3.678; A6 -0.25,3.678; A7 0.25,3.678; A8 1.25,3.678; A9 2.55,3.678; A12 3.35,3.678; B1 3.05,3.678; B4 2.25,3.678; B5 1.75,3.678; B6 0.75,3.678; B7 -0.75,3.678; B8 -1.75,3.678; B9 -2.25,3.678; B12 -3.05,3.678 | smd 2.18 x 2: MP1 -5.11,-0.827; MP2 5.11,-0.827; MP3 -5.11,3.103; MP4 5.11,3.103 | hole 0.65: -2.89,2.603; 2.89,2.603
JST04_1MM_RA = smd 0.6 x 1.35: 1 -1.5,0; 2 -0.5,0; 3 0.5,0; 4 1.5,0 | smd 1.2 x 2: NC1 2.8,-3.675; NC2 -2.8,-3.675
112ATAARR03ATTEND = smd 1.8 x 1.2: G1 10.6,10.4; G2 4.9,10.4; S1 7.75,10.4; S2 2.05,10.4 | smd 1.4 x 1.9: G3 13.6,-3.85; G4 0.45,-2.85 | smd 0.7 x 1.5: P1 8.8,0; P2 7.7,0.4; P3 6.6,0; P4 5.5,-0.2; P5 4.4,0; P6 3.3,-0.2; P7 2.2,0; P8 1.1,0
IND_4828-WE-TPC_WRE = smd 0.127 x 0.127: 1 -2.286,0; 2 2.286,0
ESP32_WROVER_SPARKFUN-IC-POWER_SOT23-5 = smd 0.55 x 1.2: 1 -0.95,-1.3; 2 0,-1.3; 3 0.95,-1.3; 4 0.95,1.3; 5 -0.95,1.3
ESP32C6_VARISTOR_CT/CN1812 = smd 1.5 x 3.6: 1 -2.25,0; 2 2.25,0
ESP32_WROVER_SPARKFUN-DISCRETESEMI_SOT23-3 = smd 0.8 x 0.9: 1 -0.95,-1; 2 0.95,-1; 3 0,1.1
SOT65P210X110-3N = smd 1.05 x 0.5: 1 -1.05,0.65; 2 -1.05,-0.65; 3 1.05,0
ESP32_WROVER_EAGLE-LTSPICE_R0402 = smd 0.7 x 0.9: 1 -0.65,0; 2 0.65,0
ESP32_WROVER_BME680_PSON80P300X300X100-8N = smd 1.016 x 0.5: 1 1.458,1.2; 2 1.458,0.4; 3 1.458,-0.4; 4 1.458,-1.2; 5 -1.458,-1.22; 6 -1.458,-0.4; 7 -1.458,0.4; 8 -1.458,1.2
SJ = smd 1.168 x 1.6: 1 -0.762,0; 2 0.762,0
TP20R = smd 2 x 2: TP 0,0
SON127P600X800X80-9N = smd 0.94 x 0.44: 1 -3.895,1.905; 2 -3.895,0.635; 3 -3.895,-0.635; 4 -3.895,-1.905; 5 3.895,-1.905; 6 3.895,-0.635; 7 3.895,0.635; 8 3.895,1.905 | smd 3.4 x 4.3: 9 0,0
XCVR_ESP32-C6-WROOM-1-N8 = smd 1.5 x 0.9: 1 -8.75,5.26; 2 -8.75,3.99; 3 -8.75,2.72; 4 -8.75,1.45; 5 -8.75,0.18; 6 -8.75,-1.09; 7 -8.75,-2.36; 8 -8.75,-3.63; 9 -8.75,-4.9; 10 -8.75,-6.17; 11 -8.75,-7.44; 12 -8.75,-8.71; 13 -8.75,-9.98; 14 -8.75,-11.25; 15 8.75,-11.25; 16 8.75,-9.98; 17 8.75,-8.71; 18 8.75,-7.44; 19 8.75,-6.17; 20 8.75,-4.9; 21 8.75,-3.63; 22 8.75,-2.36; 23 8.75,-1.09; 24 8.75,0.18; 25 8.75,1.45; 26 8.75,2.72; 27 8.75,3.99; 28 8.75,5.26 | smd 0.8 x 0.8: 29_1 -2.755,0.79; 29_2 -1.505,0.79; 29_3 -0.255,0.79; 29_4 -2.755,-0.46; 29_5 -1.505,-0.46; 29_6 -0.255,-0.46; 29_7 -2.755,-1.71; 29_8 -1.505,-1.71; 29_9 -0.255,-1.71
SOIC127P1032X265-16N = smd 2.05 x 0.59: 1 -4.655,4.445; 2 -4.655,3.175; 3 -4.655,1.905; 4 -4.655,0.635; 5 -4.655,-0.635; 6 -4.655,-1.905; 7 -4.655,-3.175; 8 -4.655,-4.445; 9 4.655,-4.445; 10 4.655,-3.175; 11 4.655,-1.905; 12 4.655,-0.635; 13 4.655,0.635; 14 4.655,1.905; 15 4.655,3.175; 16 4.655,4.445
SON50P200X200X80-9N = smd 0.76 x 0.27: 1 -0.985,0.75; 2 -0.985,0.25; 3 -0.985,-0.25; 4 -0.985,-0.75; 5 0.985,-0.75; 6 0.985,-0.25; 7 0.985,0.25; 8 0.985,0.75 | smd 0.9 x 1.3: 9 0,0

### Placement (x,y rotation side)
BOOT_BUTTON  23.85,107.29 180 top
C1  154.08,6.94 90 top
C1_BAT  119.78,42.16 0 top
C1_BAT1  140.08,30.91 90 top
C1_BAT2  123.09,30.2 0 top
C2  152.46,6.93 90 top
C2_BAT  136.51,45.52 90 top
C3  133.68,32.13 90 top
C4  92.2,40.22 270 top
C4_USB  150.96,55.84 90 top
C5  52.23,107.46 90 top
C5_USB  158.92,58.4 90 top
C6  27.34,107.49 90 top
C7  78.85,34.24 0 top
C8  89.59,49.24 0 top
C9  6.68,99.47 90 top
C10  68.02,107.42 90 top
C10_SUPERCAP  95.74,51.6 90 top
C_DELAY  50.17,94.16 90 top
CHANGE_BUTTON  64.44,107.29 180 top
CHG_LED  126.66,44.1 90 top
D1  155.26,56.15 90 top
D2  121.26,35.15 90 top
D3  87.5,41.27 0 top
D4  89.61,35.61 0 top
D5  75.15,45.34 90 top
D6  73.51,33.77 0 top
D7  85.6,65.82 0 top
D8  13.76,98.16 0 top
D9  37.65,31.93 90 top
D10  49.32,23.61 90 top
D11  45.96,23.61 90 top
D12  42.34,23.56 90 top
EPD_C1  89.49,19.73 90 top
EPD_C2  87.77,19.83 90 top
EPD_C5\  85.95,19.81 90 top
EPD_C6  84.13,19.7 90 top
EPD_C7  82.1,19.62 90 top
EPD_C8  80.02,19.73 90 top
EPD_C9  78.07,19.68 90 top
EPD_C10  76.08,19.61 90 top
EPD_C11  72.89,19.57 90 top
EPD_C12  74.18,19.55 90 top
IC1  46.64,94 0 top
IC4  127.07,34.69 0 top
J1  82.66,14.46 0 top
J2  167.28,54.3 90 top
J3  164.43,19.31 90 top
J4  5.89,96 270 top
L1  78.42,38.03 0 top
MCP73831  132.5,43.29 90 top
PFMF.050.1  155.18,43.26 0 top
Q1  134.62,38.32 0 top
Q2  73.31,36.63 270 top
Q3  67.7,15.71 0 top
R1  19.18,27.34 90 top
R1_BAT  119.74,43.95 0 top
R1_PINH  155.57,6.92 90 top
R1_PINH1  86.17,63.67 0 top
R1_PWRUSB  119.31,35.18 90 top
R2  68.2,11.81 0 top
R2-PINH  157.17,6.97 90 top
R2-PINH1  93.94,60.05 90 top
R2-USB  156,48.73 0 top
R2-USB1  155.95,50.19 0 top
R2_BAT  123.69,38.87 90 top
R3  72.12,9.69 90 top
R4  72.01,13.54 0 top
R5  35.94,31.93 90 top
R6  49.55,19.26 90 top
R7  46.04,19.32 90 top
R8  42.22,19.16 90 top
R9  67.42,36.03 90 top
R10  7.97,99.45 90 top
R_BOOT  20.65,107.41 90 top
R_CAPACITOR  92.8,51.2 90 top
R_CHANGE  59.98,107.51 90 top
R_CL1  69.36,36.03 90 top
R_RESET  45.52,107.38 90 top
RESET_BUTTON  48.83,107.29 180 top
SENSOR2  157.13,17.45 90 top
SJ1  68.34,9.47 0 top
TP1  19.43,55.03 0 top
TP2  14.35,55.03 0 top
TP3  139.56,48.73 0 top
TP4  128.23,53.93 0 top
TP5  139.73,43.96 0 top
TP6  14.6,73.67 0 top
TP7  9.52,73.67 0 top
TP8  4.44,73.67 0 top
TP9  127.09,15.85 0 top
TP10  126.96,11.29 0 top
TP11  113.58,15.45 0 top
TP12  119.96,11.29 0 top
TP13  113.87,10.9 0 top
TP14  128.37,50.27 0 top
TP15  81.57,67.37 0 top
TP16  10.46,25.94 0 top
TP17  120.19,15.76 0 top
U1  39.77,42.02 0 top
U2  13,40.64 90 top
U3  84.62,56.52 270 top
U4  139.49,40.64 0 top

### Tracks (layer width: path | path; a pad name or v marks a point on that pad's centre or on a via)
3V3  (via drill 0.35)
  Top 0.152: 44.75,94.25 44.25,94.75 44.25,105.75 | 44.75,94.25 45,94 IC1.2 | 44.25,105.75 44.25,106.5 45.5,106.5 R_RESET.1 | 44.25,105.75 52.5,105.75 53.5,106.75 59.75,106.75 R_CHANGE.1 | 19.5,105.75 14,100.25 8,100.25 R10.2 7.75,100 6.75,99 C9.1 7.5,98 8,98 8,92.25 6.75,91 6,91 5.75,90.75 J4.P4 | 19.5,105.75 20.5,106.75 R_BOOT.1 | 19.5,105.75 44.25,105.75 | 129.5,29.5 132.5,29.5 133.5,30.5 C3.+ 133.75,30.5 144,20.25 164,20.25 164.25,20 J3.3 | 129.5,29.5 123,29.5 122.5,30 C1_BAT2.1 | v129.5,35.75 128.5,35.75 IC4.5 | 129.5,29.5 v129.5,31.25 | R8.2 42.25,19.75 46,19.75 R7.2 46.25,20 49.5,20 R6.2 49.75,19.75 50.25,19.25 50.25,17.25 34.75,17.25 | U2.2 9.25,31.75 9.25,26 10.25,26 TP16.TP 10.5,26 17.25,26 19,27.75 R1.2 19.25,27.75 20.5,27.75 31,17.25 34.75,17.25 | D7.2 86.75,65.75 86.75,63.75 R1_PINH1.2 87,63.5 87,62.5 87.75,61.75 87.75,61.25 U3.2 | 88,60.5 88.75,59.75 93,59.75 93.75,60.5 R2-PINH1.2 | 88,60.5 88,61 U3.2 | R9.2 67.5,36.75 69.25,36.75 R_CL1.2 69.5,36.75 v70.5,36.75 74.25,36.75 Q2.3 | U1.7 43.75,42.75 43.75,43.75 U1.8 43.5,44 43,44.5 38,44.5 36.75,43.25 36.75,41.5 36,41.5 U1.3 35.75,41.25 35.5,41.25 v35,40.75 | v34.75,32.75 35.75,32.75 R5.2 | 88,60.5 82.5,55 v82.25,55 | 88,60.5 U3.2 | v34.75,28.25 34.75,17.25 | v44.25,93.75 44.75,94.25
  Bottom 0.152: v129.5,31.25 v129.5,35.75 110.25,55 v82.25,55 67.25,40 | 67.25,40 62,45.25 44.25,45.25 | 67.25,40 v70.5,36.75 | 44.25,45.25 35,45.25 v35,40.75 35,33 v34.75,32.75 v34.75,28.25 | 44.25,45.25 v44.25,93.75
32KHZ  (via drill 0.35)
  Top 0.152: U3.1 89.25,61.25 89.5,61.5 94.75,61.5 94.75,60.25 94,59.5 R2-PINH1.1 93.75,59.25 93,59.25 88,54.25 41.25,54.25 v41,54.5 | v19.75,33.25 18,33.25 18,32 U2.9
  Bottom 0.152: v41,54.5 v19.75,33.25
DN  (via drill 0.35)
  Top 0.152: v159.75,54.25 160,54.5 163.5,54.5 J2.A7 | v157.25,56.75 156.75,57.25 156.25,57.25 D1.4
  Bottom 0.152: v157.25,56.75 v159.75,54.25
DP
  Top 0.152: J2.A6 163.75,54 164.25,54 164.5,54.25 164.5,55 163.75,55 J2.B6 163.5,55 158,55 156.75,56.25 154.5,56.25 154.5,57.25 D1.6
EPD_3V3  (via drill 0.35)
  Top 0.152: 78.25,35 78.25,38 80.75,38 | 78.25,35 78.25,34.25 C7.1 | 78.25,35 73,35 72.5,35.5 Q2.2 | 81.5,16 81,16 J1.16 | 84.75,18 84.5,17.75 82,17.75 81.5,17.25 81.5,16 | 84.75,18 85.75,19 EPD_C5\.1 | 81.5,16 J1.15 | v89.25,16.25 90.75,16.25 91.25,16.75 119.25,16.75 120,16 TP17.TP | 84.75,18 v85,17.75 | v85,33.75 80.75,38 | 80.75,38 L1.2
  Bottom 0.152: v89.25,16.25 85,16.25 v85,17.75 v85,33.75
EPD_3V3_C  (via drill 0.35)
  Top 0.152: 66.5,37.5 66.5,36.25 66.75,36 68.75,36 69.25,35.5 R_CL1.1 | 66.5,37.5 72.25,37.5 Q2.1 72.25,37.75 75.5,41 81.25,41 82.75,39.5 v87.5,39.5 | v21.5,47.75 20.5,47.75 20.5,49.25 U2.18 | v24.75,39.25 26.5,37.5 66.5,37.5 | v113.75,13.25 113.75,11 TP13.TP
  Bottom 0.152: v21.5,47.75 24.75,44.5 v24.75,39.25 | v87.5,39.5 v113.75,13.25
EPD_BUSY  (via drill 0.35)
  Top 0.152: v84.5,14.75 84.5,15.75 J1.9 | v111,15 112,14 125.25,14 127,15.75 TP9.TP | v74.75,45.25 73.5,46.5 10.5,46.5 10.5,49.25 U2.26
  Bottom 0.152: v111,15 111,15.5 86.75,15.5 86.25,15 86.25,14.75 v84.5,14.75 84.5,16.75 79.25,22 79.25,40.75 v74.75,45.25
EPD_C2
  Top 0.152: 86.5,16 86,16 J1.6 | 86.5,16 86.5,18 86.75,18.25 86.75,19.5 87.25,20 87.5,20 87.75,20.25 EPD_C2.2 | 86.5,16 J1.5
EPD_CS  (via drill 0.35)
  Top 0.152: v83.25,17 83,17 83,16 J1.12 | 68.25,34.5 67.5,35.25 R9.1 67.25,35.25 61,29 20.5,29 20.5,31.75 U2.11 | 68.25,34.5 v78,24.75 v108.25,24.75 | 68.25,34.5 73.75,34.5 74.25,34 D6.2 | v121.5,11.5 126.75,11.5 TP10.TP
  Bottom 0.152: v83.25,17 78,22.25 v78,24.75 | v108.25,24.75 v121.5,11.5
EPD_DC  (via drill 0.35)
  Top 0.152: v83.5,14.75 83.5,15.75 J1.11 | v106.5,11.5 110.75,15.75 113.25,15.75 113.5,15.5 TP11.TP | v34,21.75 27.25,21.75 20.25,28.75 13,28.75 13,31.75 U2.5
  Bottom 0.152: v106.5,11.5 86.5,11.5 86,12 86,12.25 v83.5,14.75 83.5,14 77.75,14 77.25,14.5 41.25,14.5 v34,21.75
EPD_RST  (via drill 0.35)
  Top 0.152: v85.75,17 84,17 84,16 J1.10 | v90.5,17 90.75,17.25 127.5,17.25 128.5,16.25 128.5,12.75 121.25,12.75 120,11.5 TP12.TP | v83,46 74.75,46 73.75,47 16.75,47 16.75,49.25 U2.21
  Bottom 0.152: v90.5,17 v85.75,17 85.75,43.25 v83,46
FLASH_CS  (via drill 0.35)
  Top 0.152: R5.1 36,31.5 37,32.5 37.5,32.5 D9.2 37.5,32.75 v36.75,33.5 21.75,33.5 21.75,32 U2.12 | v36.75,44.5 36.5,44.5 36,44 U1.1
  Bottom 0.152: v36.75,33.5 v36.75,44.5
GDR  (via drill 0.35)
  Top 0.152: v76.75,13 87,13 87.25,12.75 90,12.75 90,13.75 89.5,14.25 88,14.25 88,15.75 J1.2 | v73.75,13 73.25,13.5 72.75,13.5 R4.2 72.5,13.75 71.75,14.5 68.5,14.5 66.75,16.25 Q3.1
  Bottom 0.152: v73.75,13 v76.75,13
GND  (via drill 0.35)  (4 unrouted)
  Top 0.152: 78.5,33 79.5,34 C7.2 | 78.5,33 73.75,33 73,33.75 D6.1 | 78.5,33 85.75,33 85.75,35 87.25,36.5 88.25,36.5 88.25,39.75 87.75,40.25 86.75,40.25 85.75,41.25 D3.1 85.75,41.5 82.75,44.5 46.5,44.5 44,42 40,42 U1.9 39.75,42 37.75,42 36,40.25 U1.4 35.75,40 24.5,40 21.5,37 | 21.5,37 15.5,37 14.75,37.75 U2.29_7 14.75,38 14.75,39 U2.29_8 14.75,39.25 14.75,40.25 U2.29_9 14.5,40.5 13.5,40.5 U2.29_6 13.25,40.5 12.25,40.5 U2.29_3 12.25,40.25 12.25,39.25 U2.29_2 12.25,39 12.25,38 | 21.5,37 44,37 44,34 43.5,33.5 40,33.5 37.75,31.25 D9.1 | BOOT_BUTTON.2 25.75,106.75 26,106.75 27.25,108 C6.2 27.5,108 27.75,107.75 43.25,107.75 v43.5,107.5 | v53.25,107.5 52.75,107.5 52.25,108 C5.2 | 49.5,107.25 50,106.75 50.5,106.75 RESET_BUTTON.2 | 49.5,107.25 47.75,107.25 47.25,106.75 RESET_BUTTON.1 | 49.5,107.25 v49.25,107.5 | 14.75,91.25 16.25,91.25 J4.G2 16.5,91.25 18.25,93 45,93 IC1.3 45.25,93.25 47,93.25 48,94.25 48.5,94.25 49,94.75 50,94.75 C_DELAY.2 50.25,95 54.5,95 v60,100.5 66,106.5 CHANGE_BUTTON.2 66.25,106.75 66.75,106.75 68,108 C10.2 | 14.75,91.25 13.25,91.25 13.25,98 D8.1 | 14.75,91.25 14.75,87 16.25,85.5 J4.G1 16.25,85.25 16.25,75.5 13.25,75.5 12.75,75 12.75,66.25 13,66 13,65 2.25,65 | C9.2 6.5,100 3.25,96.75 3.25,95.75 J4.G4 3,95.5 2.25,95.5 2.25,82.5 J4.G3 2.25,82.25 2.25,65 | U2.29_5 13.5,39 13.5,38 U2.29_4 13.25,38 12.25,38 | 12.25,38 U2.29_1 12,37.75 7.75,37.75 | 7.75,37.75 7.75,32 U2.1 7.75,31.75 7.75,16.75 55.5,16.75 | 7.75,37.75 7.75,49.25 U2.28 7.5,49.5 7.25,49.75 2.25,49.75 2.25,65 | C8.2 90.75,49.75 94.75,49.75 95.5,50.5 C10_SUPERCAP.1 | 88.25,50 89.5,50 C8.2
  Top 0.152: 88.25,50 85.5,50 85.5,51.75 U3.13 | C8.2 | R2_BAT.2 123.5,39.75 122.75,39.75 120.5,42 C1_BAT.2 120.25,42.25 119.25,43.25 118.5,43.25 118.5,44.75 | TP5.TP 139.5,43.75 139.25,43.5 v135.75,43.5 134,43.5 MCP73831.2 133.75,43.5 133.25,43.5 132,44.75 118.5,44.75 | 88.25,50 88.25,48.75 92.25,44.75 118.5,44.75 | 139.5,40.5 139,40 138.75,40 U4.4 | U4.1 138.75,41.5 139.5,40.75 U4.9 139.5,40.5 | 139.5,40.5 140.25,40.5 U4.6 140.5,40.5 141.5,40.5 | TP4.TP 128.25,53.75 129,53.75 v135.75,47 136.5,46.25 C2_BAT.2 136.75,46 142.25,46 | 141.5,40.5 141.75,40.5 142.25,41 142.25,46 | 152.75,56 154.25,56 154.5,55.75 154.75,55.75 155.5,55 D1.2 | 152.75,56 151.25,56 151,56.25 C4_USB.2 | 166.25,59.5 164.25,59.5 J2.MP4 164,59.25 159,59.25 C5_USB.2 158.75,59 152.75,59 152.75,56 | 166.25,59.5 168,59.5 J2.MP2 | 156.75,49.5 156.75,50 R2-USB1.2 | 156.75,49.5 156.75,49.25 | 156.75,49.25 156.75,48.75 R2-USB.2 | J3.4 164.25,21 164.25,49 J2.MP3 | 156.75,49.25 164,49.25 J2.MP3 | 166.25,49.25 164.25,49.25 J2.MP3 | 166.25,49.25 168,49.25 J2.MP1 | 166.25,49.25 166.25,59.5 | 142.25,46 145.75,49.5 156.75,49.5 | EPD_C2.1 88,19 89.25,19 EPD_C1.1 89.25,19.25 88.5,20 88.5,21.25 | 88.5,21.25 86.75,21.25 86,20.5 EPD_C5\.2 85.75,20.5 84.25,20.5 EPD_C6.2 84,20.25 82.25,20.25 EPD_C7.2 82,20.5 80.25,20.5 EPD_C8.2 80,20.5 78.25,20.5 EPD_C9.2 78,20.25 76.25,20.25 EPD_C10.2 76,20.25 74.25,20.25 EPD_C12.2 74,20.25 73,20.25 EPD_C11.2 72.75,20 72,19.25 72,14.75 73.25,14.75 75.25,12.75 | D12.1 42.5,23 45.75,23 D11.1 46,23 49.25,23 D10.1 49.5,22.75 55.5,16.75 | R2.1 67.5,11.75 67.5,9.5 SJ1.1 | 75.25,12.75 74.75,12.25 72.75,12.25 72,13
  Top 0.152: 75.25,12.75 J1.MP2 76.25,13.75 80.5,13.75 | 72,13 71.5,13.5 R4.1 | 80.5,13.75 80.5,15.75 J1.17 | 80.5,13.75 86.5,13.75 | 86.5,13.75 89,13.75 89.25,13.5 J1.MP1 | 86.5,13.75 85,15.25 85,15.75 J1.8 | 72,13 68.75,13 67.75,12 R2.1 | 55.5,16.75 60.25,12 67.5,12 R2.1 | C2.2 152.5,7.5 154,7.5 C1.2 154.25,7.75 154.25,16.75 | 156.75,16.75 156.75,16 SENSOR2.7 | 156.75,16.75 158,16.75 158.25,16.5 158.25,16 SENSOR2.5 | 156,16.75 156,18.75 SENSOR2.1 | 156.75,16.75 156,16.75 | 156,16.75 154.25,16.75 | 135.5,33.5 133.75,33.5 C3.- 133.5,33.5 133,33 126.5,33 | 135.5,33.5 138.25,33.5 140,31.75 C1_BAT1.2 | R1_PWRUSB.1 119.5,34.75 125.5,34.75 IC4.2 125.75,34.5 126.5,34.5 126.5,33 | 126.5,33 124.5,31 | 124.5,31 123.75,30.25 C1_BAT2.2 | 154.25,16.75 151.25,19.75 131.75,19.75 121.75,29.75 | 121.75,29.75 121.75,31 124.5,31 | 88.5,21.25 113.25,21.25 121.75,29.75 | 141.5,40.5 141.5,29.5 139.5,29.5 135.5,33.5
  Bottom 0.152: v43.5,107.5 44,108 49.25,108 v49.25,107.5 v53.25,107.5 60,100.75 v60,100.5 | v135.75,47 v135.75,43.5
GPIO8  (via drill 0.35)
  Top 0.152: v20.25,27 19.5,27 19.25,26.75 R1.1 | v19.75,30.5 19.75,31.75 19.25,31.75 U2.10
  Bottom 0.152: v20.25,27 19.75,27.5 v19.75,30.5
I2C_PW  (via drill 0.35)
  Top 0.152: R2-PINH.2 157,7.5 155.75,7.5 R1_PINH.2 155.5,7.5 155.25,7.5 154.25,6.5 C1.1 154,6.25 152.5,6.25 C2.1 152.25,6.5 v129,6.5 | v87.5,48 22.75,48 22.25,48.5 21.75,48.5 21.75,49.25 U2.17
  Bottom 0.152: v129,6.5 v87.5,48
INT_RTC  (via drill 0.35)
  Top 0.152: v16.75,33.5 16.75,32 U2.8 | v40,67.25 81.5,67.25 TP15.TP 81.75,67.25 84,65 84.25,65 85.5,63.75 R1_PINH1.1 85.75,63.5 86.5,62.75 86.5,61.25 U3.3
  Bottom 0.152: v16.75,33.5 20.75,37.5 20.75,48 v40,67.25
IO/BOOT
  Top 0.152: R_BOOT.2 20.75,108 22,108 BOOT_BUTTON.4
IO/CHANGE  (via drill 0.35)
  Top 0.152: R_CHANGE.2 60,108.25 62.5,108.25 CHANGE_BUTTON.4 62.5,108 60.75,106.25 55.75,106.25 v54.5,105 | v21,51.5 14.25,51.5 14.25,49.5 U2.23
  Bottom 0.152: v21,51.5 43.5,74 43.5,94 v54.5,105
MISO  (via drill 0.35)
  Top 0.152: v7.25,93.5 6.25,93.5 6,93.75 J4.P7 | v13.5,74.75 14.5,73.75 TP6.TP 14.5,73.5 14.5,57 11.75,57 9.25,54.5 9.25,49.5 U2.27 9.25,49.25 9.25,47.25 10.5,46 32.5,46 35.75,42.75 U1.2 35.75,42.5 v34,40.75 | 40.5,24.25 40.5,20.25 42,18.75 R8.1 | 40.5,24.25 42.25,24.25 D12.2 | 40.5,24.25 39.5,25.25 v36.75,25.25
  Bottom 0.152: v7.25,93.5 13.5,87.25 v13.5,74.75 | v36.75,25.25 34,28 v34,40.75
MOSI  (via drill 0.35)
  Top 0.152: v82.25,17 82,17 82,16 J1.14 | v77.25,41.75 77,41.5 45,41.5 43.75,40.25 U1.5 43.5,40 v43.5,38.25 | J4.P3 6,89.25 6.25,89 7.25,89 9.5,86.75 9.5,73.75 TP7.TP 9.75,73.5 v9.75,69.25 | v47.25,19.25 46.75,19.25 46.25,18.75 R7.1 | v47,23.75 46.5,24.25 46,24.25 D11.2 | 15.5,34.25 15.5,32 U2.7 | v43.25,34.25 15.5,34.25 | v11.5,36 13.25,34.25 15.5,34.25
  Bottom 0.152: v82.25,17 77.25,22 v77.25,41.75 | v47.25,19.25 47,19.5 v47,23.75 47,30.5 v43.25,34.25 43.25,38 v43.5,38.25 | v9.75,69.25 11.5,67.5 v11.5,36
N$1  (via drill 0.35)
  Top 0.152: v155.75,51.25 155.5,51.25 155.5,50.25 R2-USB1.1 | v158.5,51.25 160.25,53 163.5,53 J2.A5
  Bottom 0.152: v158.5,51.25 v155.75,51.25
N$2  (via drill 0.35)
  Top 0.152: v156,47.75 155.5,47.75 155.5,48.5 R2-USB.1 | v162.25,55.75 162.5,56 163.5,56 J2.B5
  Bottom 0.152: v156,47.75 162.25,54 v162.25,55.75
N$3
  Top 0.152: IC4.3 125.5,33.75 121.75,33.75 121.5,34 D2.1 121.25,34 121,33.75 118.75,33.75 118.5,34 118.5,35.25 126,35.25 | C1_BAT1.1 140.25,30.5 141,31.25 141,37.25 135.75,37.25 Q1.2 133.25,35 128,35 127.75,35.25 126,35.25 | 126,35.25 125.75,35.5 IC4.1
N$5  (via drill 0.35)
  Top 0.152: SENSOR2.6 157.75,15.75 157.25,15.25 156,15.25 156,15.75 SENSOR2.8 155.75,16 v155,16 | v156.75,17.75 156.75,18.75 SENSOR2.2
  Bottom 0.152: v155,16 v156.75,17.75
N$6
  Top 0.152: R2_BAT.1 123.75,38.25 127.75,42.25 131,42.25 MCP73831.5
N$7
  Top 0.152: D3.2 89.25,41.25 91.75,41.25 92,41 C4.1 92.25,40.75 93,40.75 93,39 92.75,38.75 91,38.75 D4.1
N$8  (via drill 0.35)
  Top 0.152: v49,93.75 50,93.75 C_DELAY.1 | v49,95.5 48.5,95 48.25,95 IC1.5
  Bottom 0.152: v49,95.5 v49,93.75
N$9
  Top 0.152: J1.4 87,16 87,18 89.75,18 90.25,18.5 90.25,20.25 89.5,20.25 EPD_C1.2
N$10
  Top 0.152: R1_BAT.1 119.25,43.75 120,43 132.75,43 133.25,42.5 133.75,42.5 MCP73831.1
N$11
  Top 0.152: CHG_LED.C 125.75,44 120.5,44 R1_BAT.2
N$12
  Top 0.152: J1.18 80,16 80,18 81.75,18 82,18.25 83.25,18.25 84,19 EPD_C6.1
N$13
  Top 0.152: J1.19 79.5,16 79.5,18.5 81.75,18.5 82,18.75 EPD_C7.1
N$14
  Top 0.152: J1.20 79,16 79,19 80,19 EPD_C8.1
N$15
  Top 0.152: R_CAPACITOR.2 93,52 93,58.75 94.5,58.75 95.25,59.5 95.25,66 87.75,66 87.25,66.5 85.25,66.5 84.75,66 D7.1
N$16
  Top 0.152: J1.22 78,16 78,18.25 76.75,18.25 76.25,18.75 EPD_C10.1
N$17  (via drill 0.35)
  Top 0.152: v28.5,107 27.5,107 C6.1 | v24.25,107 25.25,108 25.5,108 BOOT_BUTTON.3
  Bottom 0.152: v24.25,107 v28.5,107
N$18
  Top 0.152: J1.24 77,16 74.25,18.75 EPD_C12.1
N$19
  Top 0.152: C5.1 52,107 51,108 50.75,108 RESET_BUTTON.3
N$21  (via drill 0.35)
  Top 0.152: C10.1 66.5,105.25 v66.25,105.25 | v64.75,106.75 66,108 CHANGE_BUTTON.3
  Bottom 0.152: v64.75,106.75 v66.25,105.25
PREVGH  (via drill 0.35)
  Top 0.152: EPD_C9.1 78.25,19 78.5,19 78.5,16 J1.21 78.5,15.75 78.5,15.25 v78,14.75 | v75.25,42.25 75.25,43.5 D5.1
  Bottom 0.152: v75.25,42.25 75.75,41.75 75.75,17 v78,14.75
PREVGL  (via drill 0.35)
  Top 0.152: J1.23 77.5,15.75 77.5,15.25 76.5,15.25 v73.75,18 73,18.75 EPD_C11.1 | D4.2 84.5,28.75 v75,28.75
  Bottom 0.152: v75,28.75 73.75,27.5 v73.75,18
RESE  (via drill 0.35)
  Top 0.152: v87.25,14.5 87.5,14.5 87.5,15.75 J1.3 | v86.75,12.25 85.75,11.25 73,11.25 72.25,10.5 R3.2 72,10.5 v71.25,11.25 | v68.75,13.75 68,13.75 66.75,15 Q3.2
  Bottom 0.152: v87.25,14.5 86.75,14 v86.75,12.25 | v71.25,11.25 v68.75,13.75
RESE'
  Top 0.152: R3.1 72,9.25 69.25,9.25 SJ1.2 69,9.5 69,11.75 R2.2
RESET  (via drill 0.35)
  Top 0.152: v45,105 45,95 IC1.1 | v44.5,107.25 45.25,108 45.5,108 R_RESET.2 45.75,108 47,108 RESET_BUTTON.4 | v13,36.75 10.5,36.75 10.5,32 U2.3
  Bottom 0.152: v44.5,107.25 44.5,105.5 v45,105 20.25,80.25 20.25,44 v13,36.75
RTC_RST
  Top 0.152: U2.16 23,49.5 23,52.25 19.25,52.25 18.75,52.75 18.75,53.75 24.25,53.75 30.25,59.75 84.25,59.75 85.5,61 U3.4
RX
  Top 0.152: U2.24 13,49.5 13,55 14.25,55 TP2.TP
SCK  (via drill 0.35)
  Top 0.152: J4.P5 5.75,91.5 5.5,91.25 5,91.25 4.5,90.75 4.5,73.75 TP8.TP 4.5,73.5 v12.25,65.75 | v82.5,14.75 82.5,15.75 J1.13 | v76.5,22.5 74.75,24.25 49.5,24.25 D10.2 49.25,24.5 47.75,26 v42.5,26 36,26 36,23.5 41.75,17.75 48.75,17.75 49.5,18.5 R6.1 | v42.5,40.25 43.5,41.25 U1.6 | v15.75,30.5 14.25,30.5 14.25,31.75 U2.6
  Bottom 0.152: v82.5,14.75 76.5,20.75 v76.5,22.5 | v42.5,40.25 v42.5,26 42.5,22.75 23.5,22.75 v15.75,30.5 12.25,34 v12.25,65.75
SCL  (via drill 0.35)
  Top 0.152: 159,18.75 159,17.75 | 159,17.75 159,8.25 157.25,6.5 R2-PINH.1 | 159,18.75 158.5,18.75 SENSOR2.4 | 159,17.75 164.25,17.75 J3.1 | 141.25,41.25 141,41 140.5,41 U4.7 | 141.25,41.25 141.25,45.5 104.75,45.5 96.5,53.75 95,53.75 93.5,52.25 93.5,51.25 90.25,51.25 | 90.25,51.25 89.75,51.25 89.25,51.75 U3.16 | v22.25,50.75 18,50.75 18,49.5 U2.20 | v25.25,53.75 87.75,53.75 90.25,51.25 | v159.25,19 159,18.75 | 141.25,41.25 v141.5,41.25
  Bottom 0.152: v25.25,53.75 v22.25,50.75 | v159.25,19 141.5,36.75 v141.5,41.25
SDA  (via drill 0.35)
  Top 0.152: R1_PINH.1 155.75,6.25 156.5,5.5 157.5,5.5 165.5,13.5 165.5,18.75 164.5,18.75 J3.2 164.25,19 163.75,19 163,19.75 157.75,19.75 157.75,19 SENSOR2.3 157.75,18.75 v157.75,17.75 | 83.25,53.25 83.25,50.75 84.5,49.5 87,49.5 99,37.5 130.25,37.5 134.75,42 v139.75,42 140.25,41.5 U4.8 | 83.25,53.25 86.75,53.25 88,52 U3.15 | v19.25,48 19.25,49.25 U2.19 | v19.5,53 79.5,53 79.75,53.25 83.25,53.25
  Bottom 0.152: v19.25,48 19.5,48.25 v19.5,53 | v157.75,17.75 139.75,35.75 v139.75,42
SRC  (1 unrouted)
  Top 0.152: 87,42 83.75,45.25 83.75,47 75.25,47 D5.2 | 87,42 88.5,40.5 91.25,40.5 92,39.75 C4.2 | Q3.3 68.75,21.75 106.25,21.75 109,24.5 109,37 97.25,37 92.25,42 87,42
SS_SD  (via drill 0.35)
  Top 0.152: 8.75,99 13.75,99 14.5,98.25 D8.2 | 8.75,99 8,99 R10.1 | v11.5,35 11.5,32 U2.4 | v7.5,87.25 6.5,88.25 J4.P2 | v8.75,88.5 8.75,99
  Bottom 0.152: v11.5,35 7.5,39 v7.5,87.25 v8.75,88.5
TX
  Top 0.152: U2.25 11.75,49.5 11.75,56.5 18,56.5 19.25,55.25 TP1.TP
USB_D+  (via drill 0.35)
  Top 0.152: v152,55 154.25,55 D1.1 | v45,55.75 44.25,55 v43.5,55 | v25.25,32.75 24.5,32 24.25,32 U2.14
  Bottom 0.152: v152,55 110.75,55 110,55.75 v45,55.75 | v43.5,55 25.25,36.75 v25.25,32.75
USB_D-  (via drill 0.35)
  Top 0.152: v157.25,54.75 156.25,54.75 D1.3 | v42.5,55 v46.5,59 | v24,30.5 22.75,31.75 U2.13
  Bottom 0.152: v157.25,54.75 154.25,57.75 154.25,58.5 153.75,59 v46.5,59 | v42.5,55 24,36.5 v24,30.5
VBAT  (via drill 0.35)
  Top 0.152: 138.5,40.5 138.5,41 U4.2 | 138.5,40.5 137.5,40.5 | 137.5,40.5 135.75,40.5 134.75,39.5 Q1.3 | 138.5,40.5 U4.3 | MCP73831.3 134,44.25 136,44.25 136.5,44.75 C2_BAT.1 136.75,44.75 v137.5,44.75 | v139.5,46.75 139.5,48.5 TP3.TP | v137.5,41.25 137.5,40.5
  Bottom 0.152: v139.5,46.75 v137.5,44.75 v137.5,41.25
VBUS  (via drill 0.35)
  Top 0.152: 130,44.25 131,44.25 MCP73831.4 | 130,44.25 127.5,44.25 CHG_LED.A | D2.2 121.25,36 119.5,36 R1_PWRUSB.2 119.25,36 v119.25,36.75 133,36.75 133.5,37.25 Q1.1 | v119.25,38.25 119.25,42 C1_BAT.1 | v130,43.75 130,44.25 | 155.5,58 155.75,58.25 158.25,58.25 158.75,57.75 C5_USB.1 | 155.5,58 155.5,57.5 D1.5 | 148.5,55.25 127.75,55.25 127,54.5 127,50.5 128.25,50.5 TP14.TP | 148.5,55.25 150.75,55.25 C4_USB.1 | 155.5,58 155.25,58.25 v153.5,58.25 | 148.5,55.25 v151.5,58.25 | v153.5,47.25 157.25,43.5 PFMF.050.1.2
  Bottom 0.152: v119.25,38.25 v119.25,36.75 119.25,30.5 129.75,30.5 130.25,31 130.25,43.5 | v151.5,58.25 v153.5,58.25 153.5,48.25 | 153.5,48.25 v153.5,47.25 | 130.25,43.5 135,48.25 153.5,48.25 | 130.25,43.5 v130,43.75
VRTC
  Top 0.152: C8.1 89,49 89.5,48.5 95.5,48.5 96.75,49.75 96.75,52.5 95.75,52.5 C10_SUPERCAP.2 95.5,52.5 93.75,50.75 93,50.75 R_CAPACITOR.1 92.75,50.5 86.75,50.5 86.75,51.75 U3.14
VUSB  (4 unrouted)
(copper drawn outside any net)
  shapes: Top area x12